# EAGLE schematic automatrix (EAGLE 9.3.2)
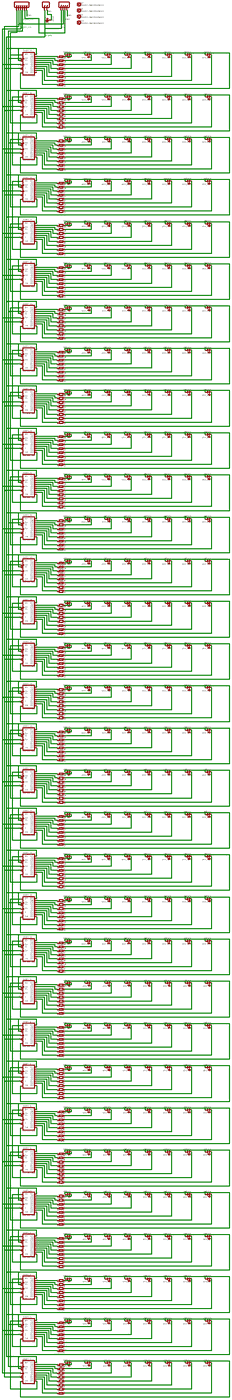
[diagram p0: schematic, sheet 1, overview]
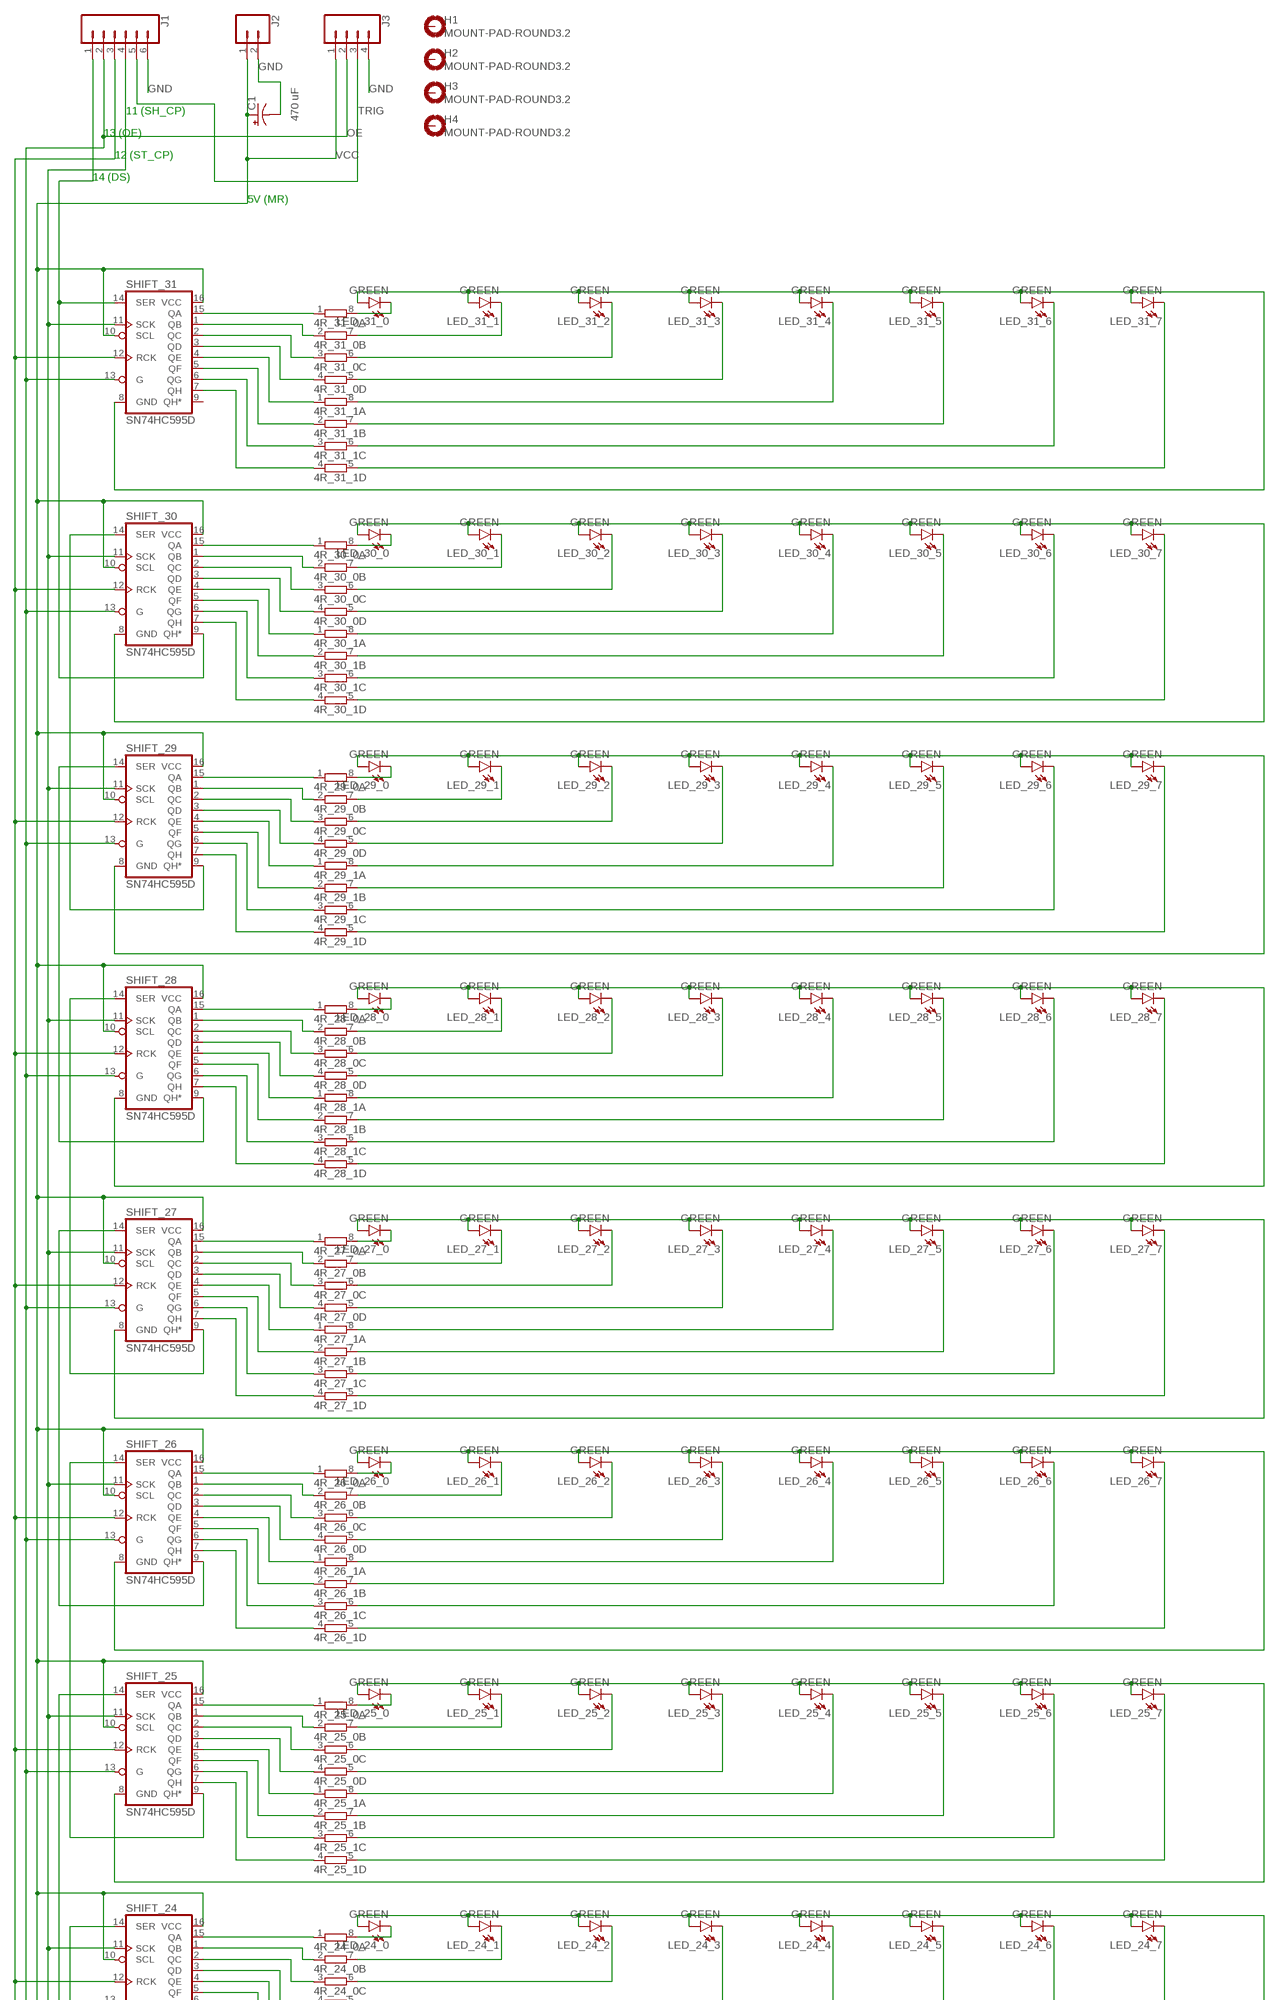
[diagram p1: schematic, sheet 1, part 1 of 4]
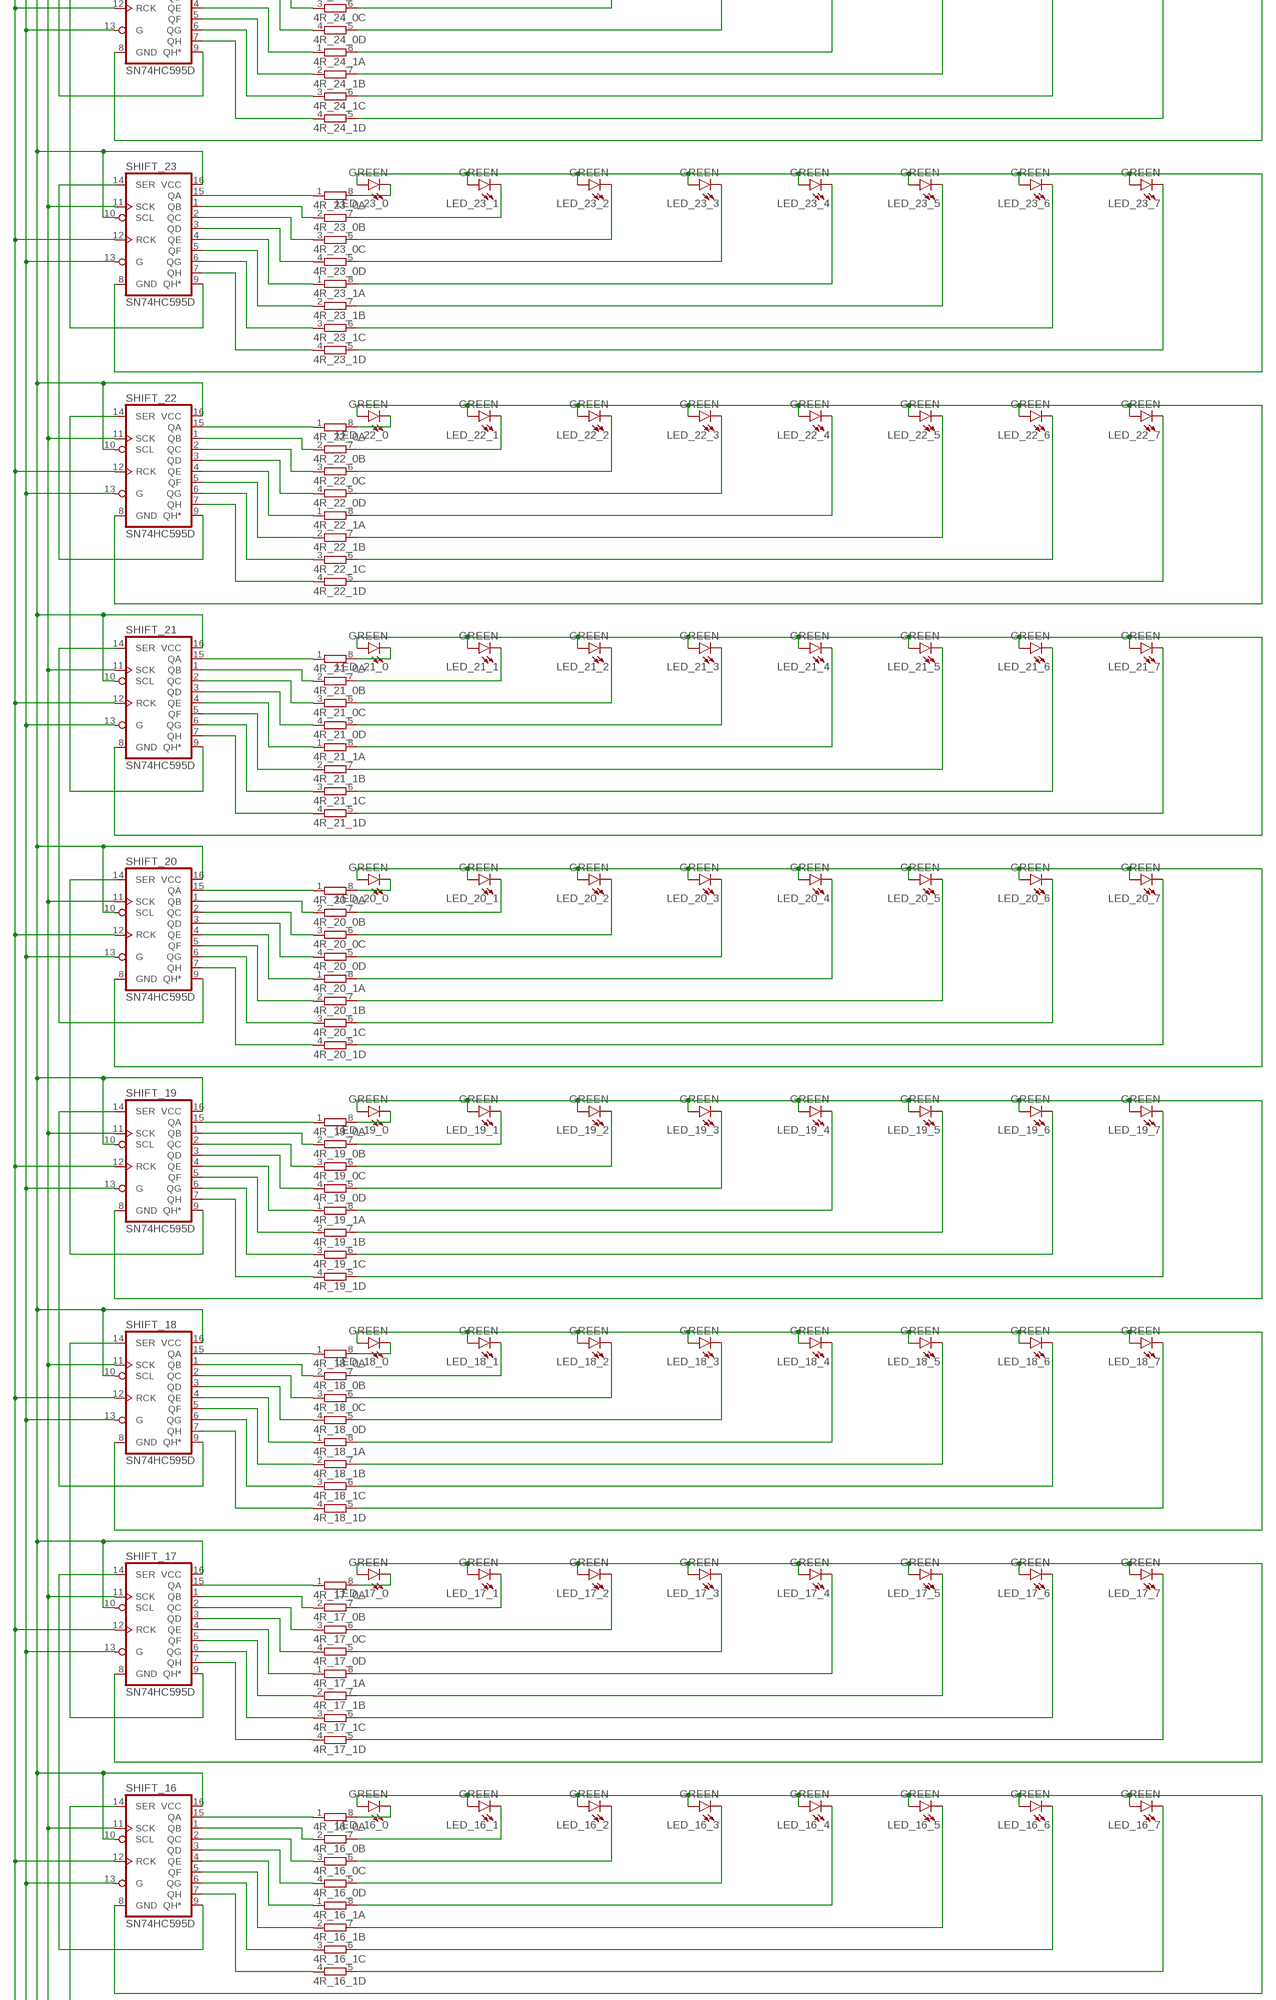
[diagram p2: schematic, sheet 1, part 2 of 4]
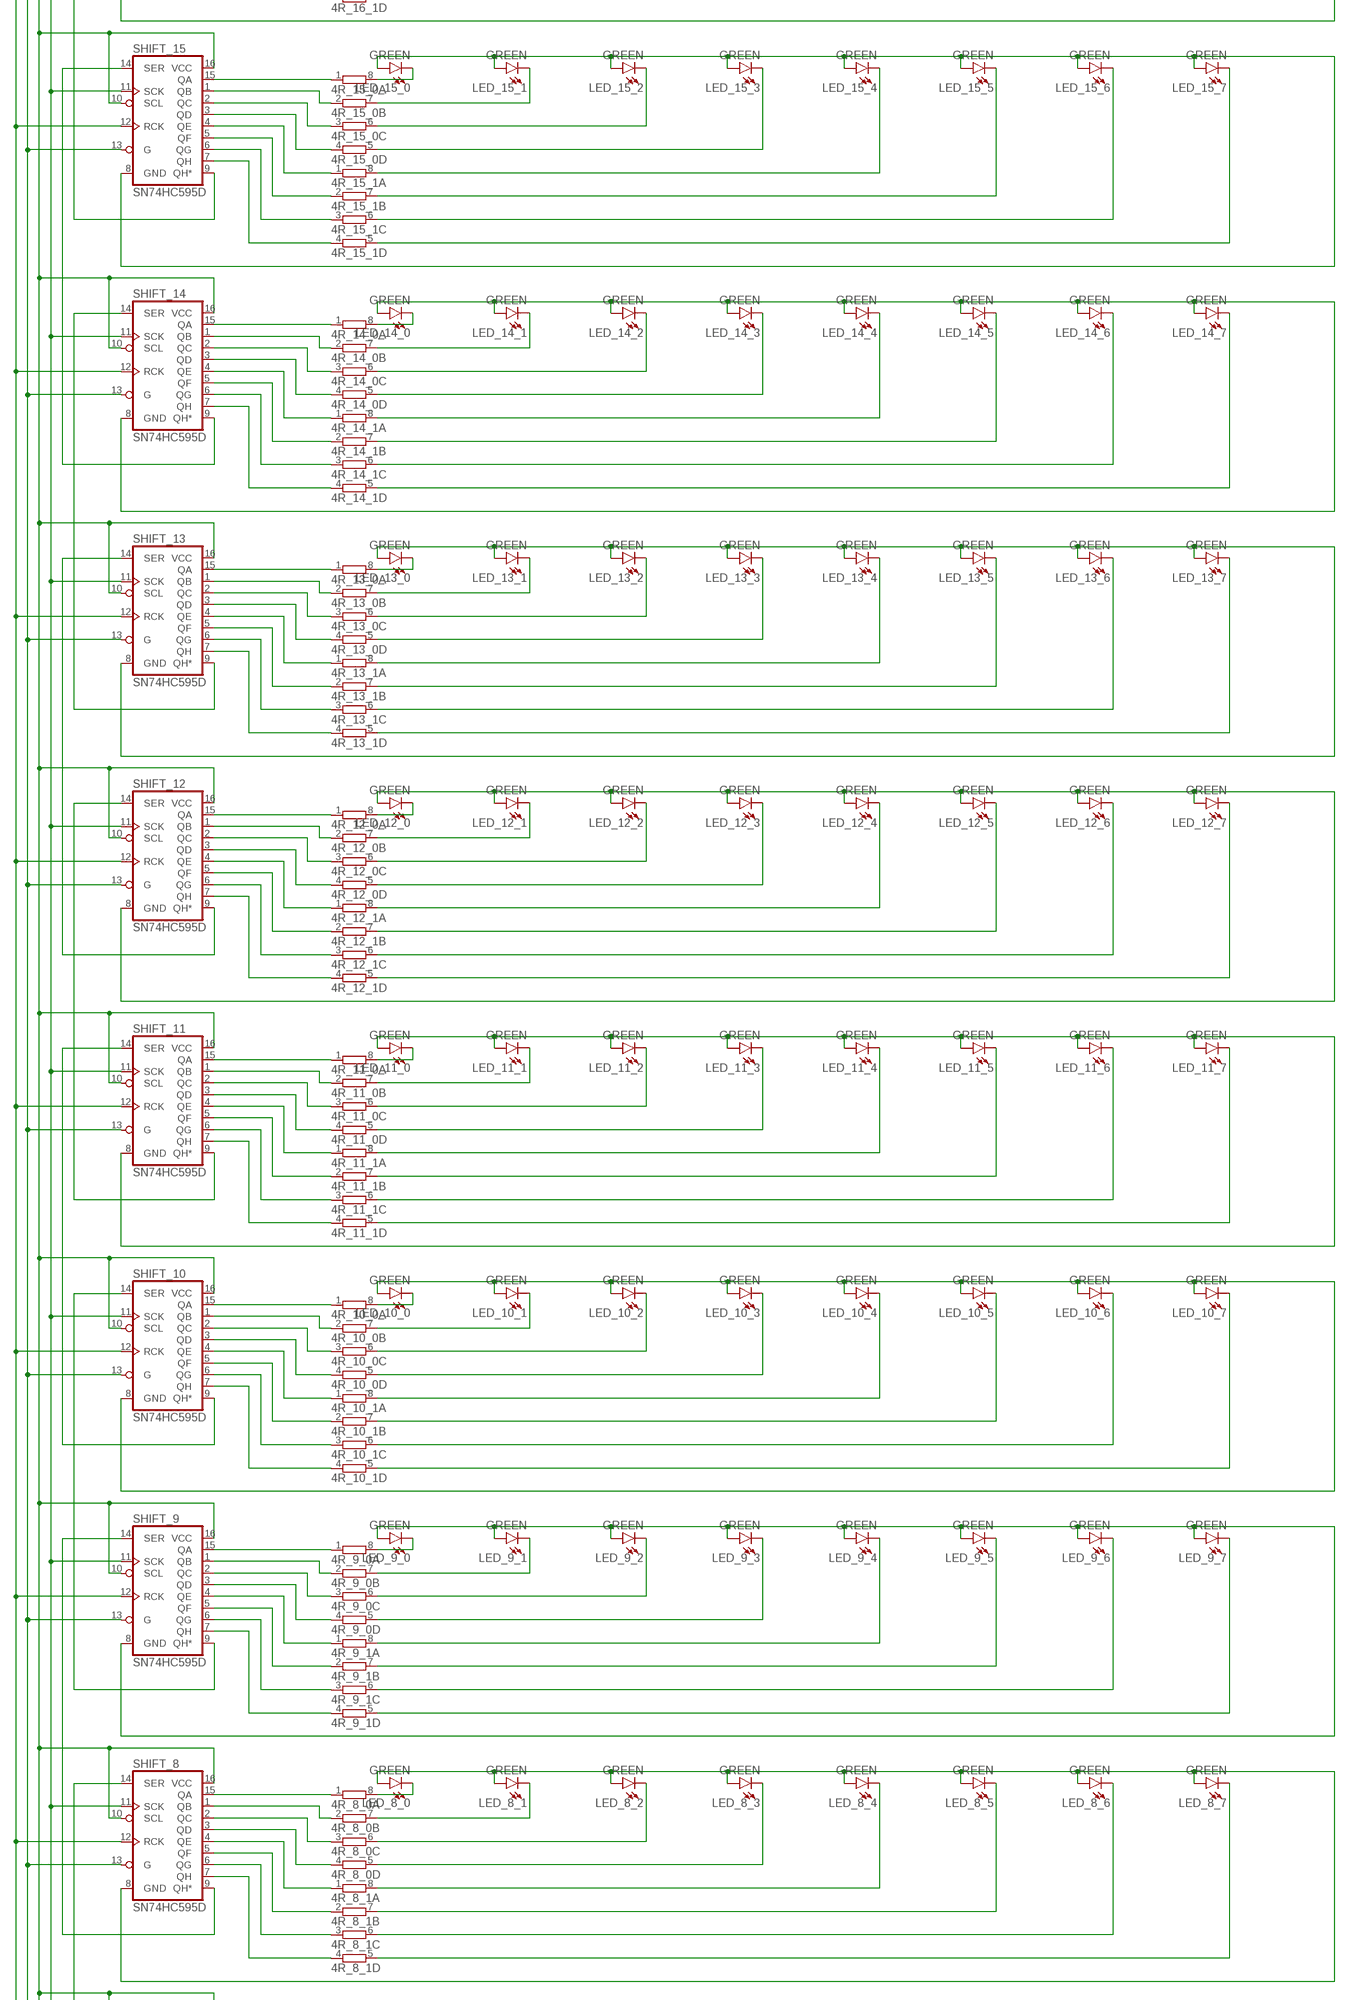
[diagram p3: schematic, sheet 1, part 3 of 4]
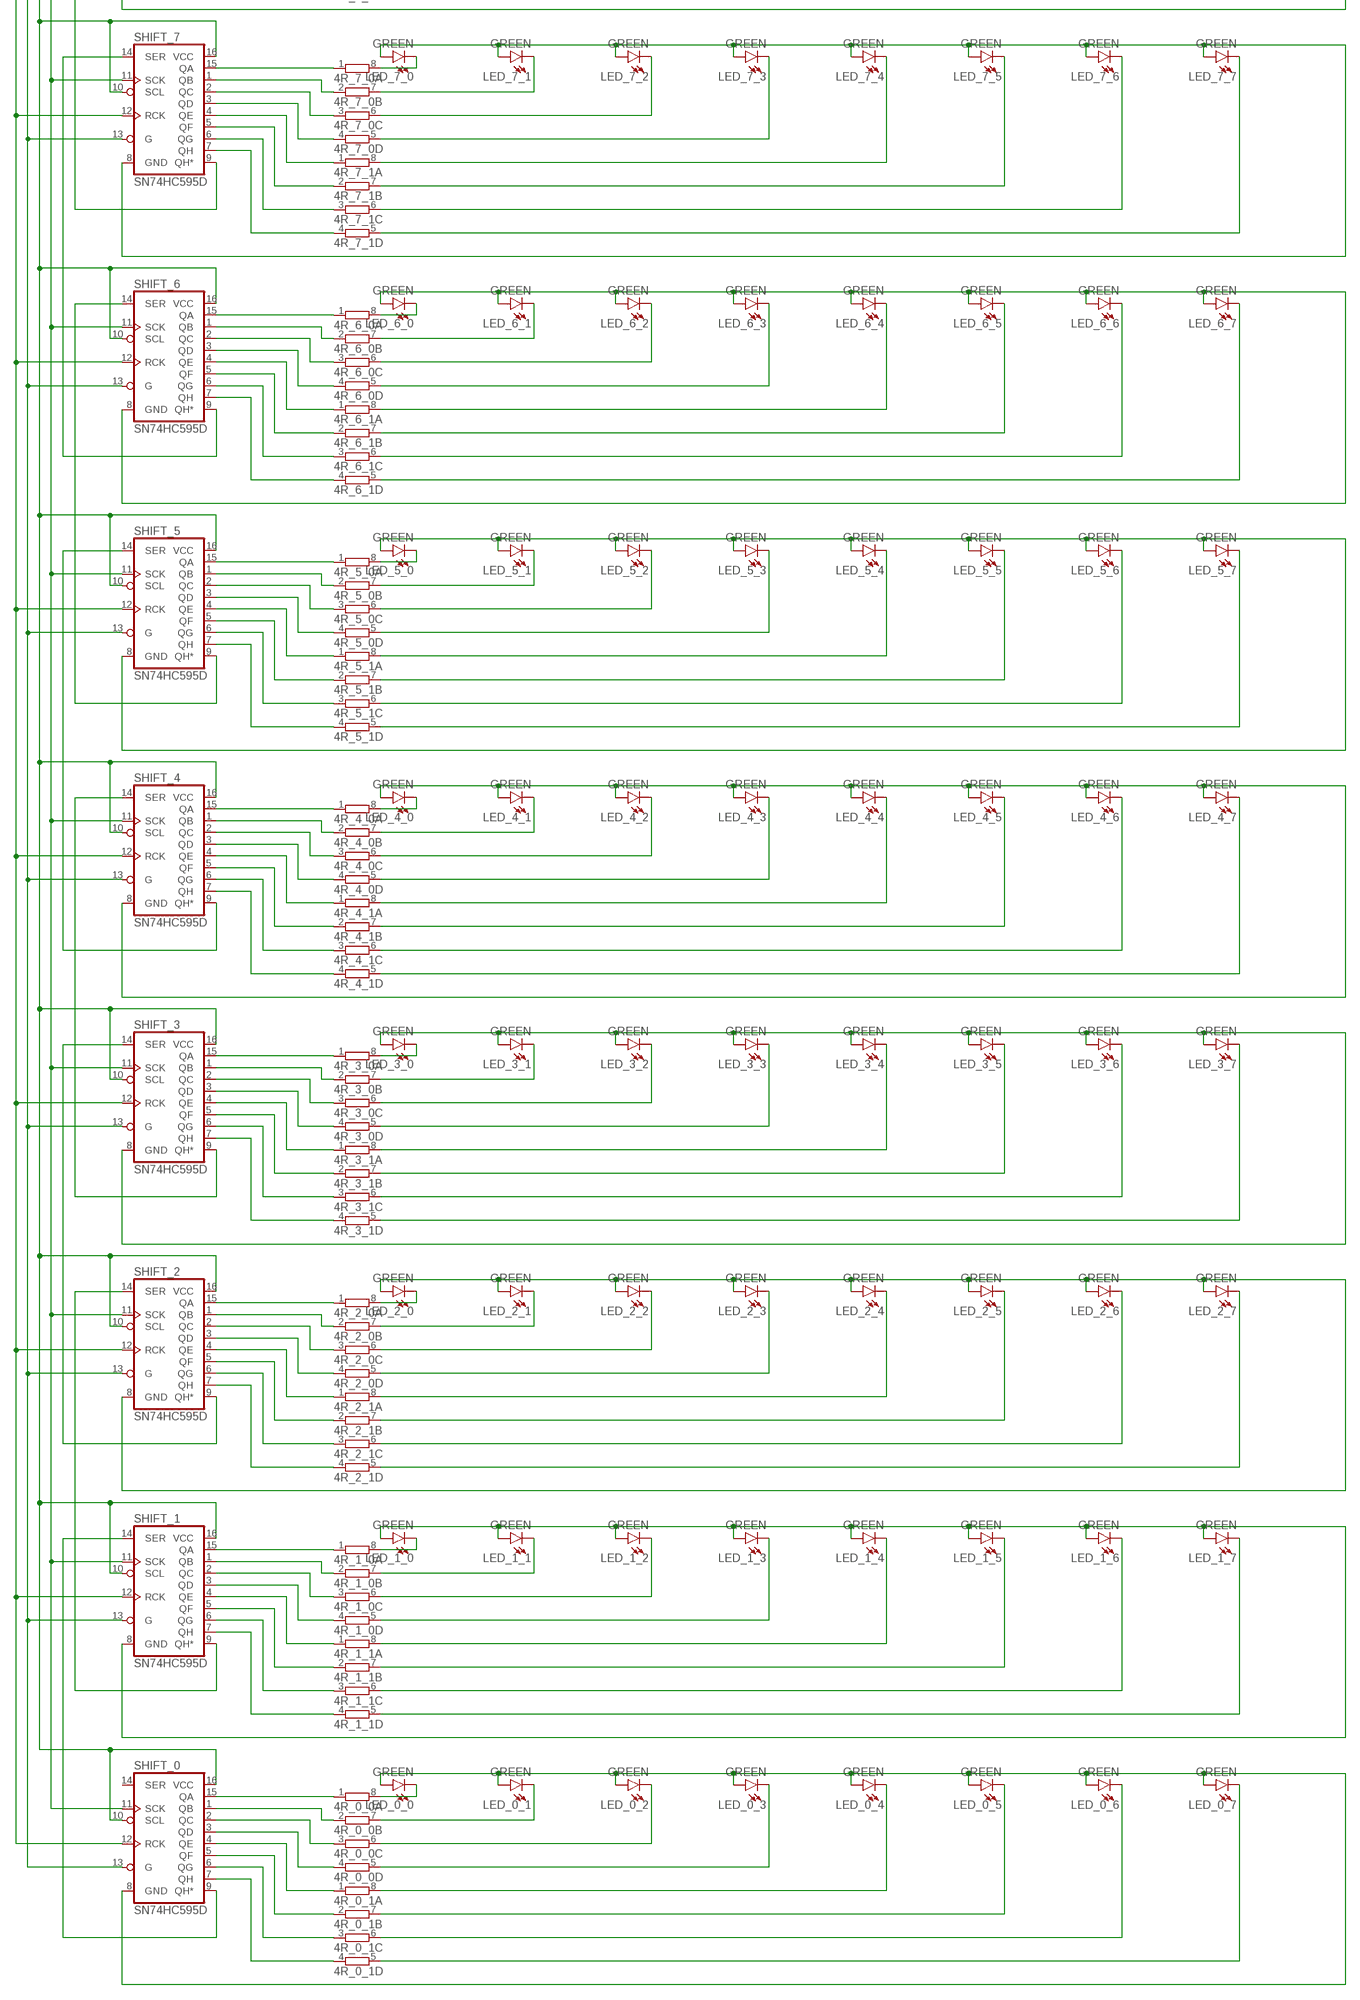
[diagram p4: schematic, sheet 1, part 4 of 4]

## Parts
4R_0_0  4R-N0603-ARC  [0603-ARC]
4R_0_1  4R-N0603-ARC  [0603-ARC]
4R_1_0  4R-N0603-ARC  [0603-ARC]
4R_1_1  4R-N0603-ARC  [0603-ARC]
4R_2_0  4R-N0603-ARC  [0603-ARC]
4R_2_1  4R-N0603-ARC  [0603-ARC]
4R_3_0  4R-N0603-ARC  [0603-ARC]
4R_3_1  4R-N0603-ARC  [0603-ARC]
4R_4_0  4R-N0603-ARC  [0603-ARC]
4R_4_1  4R-N0603-ARC  [0603-ARC]
4R_5_0  4R-N0603-ARC  [0603-ARC]
4R_5_1  4R-N0603-ARC  [0603-ARC]
4R_6_0  4R-N0603-ARC  [0603-ARC]
4R_6_1  4R-N0603-ARC  [0603-ARC]
4R_7_0  4R-N0603-ARC  [0603-ARC]
4R_7_1  4R-N0603-ARC  [0603-ARC]
4R_8_0  4R-N0603-ARC  [0603-ARC]
4R_8_1  4R-N0603-ARC  [0603-ARC]
4R_9_0  4R-N0603-ARC  [0603-ARC]
4R_9_1  4R-N0603-ARC  [0603-ARC]
4R_10_0  4R-N0603-ARC  [0603-ARC]
4R_10_1  4R-N0603-ARC  [0603-ARC]
4R_11_0  4R-N0603-ARC  [0603-ARC]
4R_11_1  4R-N0603-ARC  [0603-ARC]
4R_12_0  4R-N0603-ARC  [0603-ARC]
4R_12_1  4R-N0603-ARC  [0603-ARC]
4R_13_0  4R-N0603-ARC  [0603-ARC]
4R_13_1  4R-N0603-ARC  [0603-ARC]
4R_14_0  4R-N0603-ARC  [0603-ARC]
4R_14_1  4R-N0603-ARC  [0603-ARC]
4R_15_0  4R-N0603-ARC  [0603-ARC]
4R_15_1  4R-N0603-ARC  [0603-ARC]
4R_16_0  4R-N0603-ARC  [0603-ARC]
4R_16_1  4R-N0603-ARC  [0603-ARC]
4R_17_0  4R-N0603-ARC  [0603-ARC]
4R_17_1  4R-N0603-ARC  [0603-ARC]
4R_18_0  4R-N0603-ARC  [0603-ARC]
4R_18_1  4R-N0603-ARC  [0603-ARC]
4R_19_0  4R-N0603-ARC  [0603-ARC]
4R_19_1  4R-N0603-ARC  [0603-ARC]
4R_20_0  4R-N0603-ARC  [0603-ARC]
4R_20_1  4R-N0603-ARC  [0603-ARC]
4R_21_0  4R-N0603-ARC  [0603-ARC]
4R_21_1  4R-N0603-ARC  [0603-ARC]
4R_22_0  4R-N0603-ARC  [0603-ARC]
4R_22_1  4R-N0603-ARC  [0603-ARC]
4R_23_0  4R-N0603-ARC  [0603-ARC]
4R_23_1  4R-N0603-ARC  [0603-ARC]
4R_24_0  4R-N0603-ARC  [0603-ARC]
4R_24_1  4R-N0603-ARC  [0603-ARC]
4R_25_0  4R-N0603-ARC  [0603-ARC]
4R_25_1  4R-N0603-ARC  [0603-ARC]
4R_26_0  4R-N0603-ARC  [0603-ARC]
4R_26_1  4R-N0603-ARC  [0603-ARC]
4R_27_0  4R-N0603-ARC  [0603-ARC]
4R_27_1  4R-N0603-ARC  [0603-ARC]
4R_28_0  4R-N0603-ARC  [0603-ARC]
4R_28_1  4R-N0603-ARC  [0603-ARC]
4R_29_0  4R-N0603-ARC  [0603-ARC]
4R_29_1  4R-N0603-ARC  [0603-ARC]
4R_30_0  4R-N0603-ARC  [0603-ARC]
4R_30_1  4R-N0603-ARC  [0603-ARC]
4R_31_0  4R-N0603-ARC  [0603-ARC]
4R_31_1  4R-N0603-ARC  [0603-ARC]
C1  470 uF  1000UF-RADIAL-5MM-25V-20%  [CPOL-RADIAL-5MM-10MM]
H1  MOUNT-PAD-ROUND3.2  [3,2-PAD]
H2  MOUNT-PAD-ROUND3.2  [3,2-PAD]
H3  MOUNT-PAD-ROUND3.2  [3,2-PAD]
H4  MOUNT-PAD-ROUND3.2  [3,2-PAD]
J1  CONN_06NO_SILK_FEMALE_PTH  [1X06_NO_SILK]
J2  CONN_021X02_NO_SILK  [1X02_NO_SILK]
J3  CONN_041X04_NO_SILK  [1X04_NO_SILK]
LED_0_0  GREEN  LED-GREEN0603  [LED-0603]
LED_0_1  GREEN  LED-GREEN0603  [LED-0603]
LED_0_2  GREEN  LED-GREEN0603  [LED-0603]
LED_0_3  GREEN  LED-GREEN0603  [LED-0603]
LED_0_4  GREEN  LED-GREEN0603  [LED-0603]
LED_0_5  GREEN  LED-GREEN0603  [LED-0603]
LED_0_6  GREEN  LED-GREEN0603  [LED-0603]
LED_0_7  GREEN  LED-GREEN0603  [LED-0603]
LED_1_0  GREEN  LED-GREEN0603  [LED-0603]
LED_1_1  GREEN  LED-GREEN0603  [LED-0603]
LED_1_2  GREEN  LED-GREEN0603  [LED-0603]
LED_1_3  GREEN  LED-GREEN0603  [LED-0603]
LED_1_4  GREEN  LED-GREEN0603  [LED-0603]
LED_1_5  GREEN  LED-GREEN0603  [LED-0603]
LED_1_6  GREEN  LED-GREEN0603  [LED-0603]
LED_1_7  GREEN  LED-GREEN0603  [LED-0603]
LED_2_0  GREEN  LED-GREEN0603  [LED-0603]
LED_2_1  GREEN  LED-GREEN0603  [LED-0603]
LED_2_2  GREEN  LED-GREEN0603  [LED-0603]
LED_2_3  GREEN  LED-GREEN0603  [LED-0603]
LED_2_4  GREEN  LED-GREEN0603  [LED-0603]
LED_2_5  GREEN  LED-GREEN0603  [LED-0603]
LED_2_6  GREEN  LED-GREEN0603  [LED-0603]
LED_2_7  GREEN  LED-GREEN0603  [LED-0603]
LED_3_0  GREEN  LED-GREEN0603  [LED-0603]
LED_3_1  GREEN  LED-GREEN0603  [LED-0603]
LED_3_2  GREEN  LED-GREEN0603  [LED-0603]
LED_3_3  GREEN  LED-GREEN0603  [LED-0603]
LED_3_4  GREEN  LED-GREEN0603  [LED-0603]
LED_3_5  GREEN  LED-GREEN0603  [LED-0603]
LED_3_6  GREEN  LED-GREEN0603  [LED-0603]
LED_3_7  GREEN  LED-GREEN0603  [LED-0603]
LED_4_0  GREEN  LED-GREEN0603  [LED-0603]
LED_4_1  GREEN  LED-GREEN0603  [LED-0603]
LED_4_2  GREEN  LED-GREEN0603  [LED-0603]
LED_4_3  GREEN  LED-GREEN0603  [LED-0603]
LED_4_4  GREEN  LED-GREEN0603  [LED-0603]
LED_4_5  GREEN  LED-GREEN0603  [LED-0603]
LED_4_6  GREEN  LED-GREEN0603  [LED-0603]
LED_4_7  GREEN  LED-GREEN0603  [LED-0603]
LED_5_0  GREEN  LED-GREEN0603  [LED-0603]
LED_5_1  GREEN  LED-GREEN0603  [LED-0603]
LED_5_2  GREEN  LED-GREEN0603  [LED-0603]
LED_5_3  GREEN  LED-GREEN0603  [LED-0603]
LED_5_4  GREEN  LED-GREEN0603  [LED-0603]
LED_5_5  GREEN  LED-GREEN0603  [LED-0603]
LED_5_6  GREEN  LED-GREEN0603  [LED-0603]
LED_5_7  GREEN  LED-GREEN0603  [LED-0603]
LED_6_0  GREEN  LED-GREEN0603  [LED-0603]
LED_6_1  GREEN  LED-GREEN0603  [LED-0603]
LED_6_2  GREEN  LED-GREEN0603  [LED-0603]
LED_6_3  GREEN  LED-GREEN0603  [LED-0603]
LED_6_4  GREEN  LED-GREEN0603  [LED-0603]
LED_6_5  GREEN  LED-GREEN0603  [LED-0603]
LED_6_6  GREEN  LED-GREEN0603  [LED-0603]
LED_6_7  GREEN  LED-GREEN0603  [LED-0603]
LED_7_0  GREEN  LED-GREEN0603  [LED-0603]
LED_7_1  GREEN  LED-GREEN0603  [LED-0603]
LED_7_2  GREEN  LED-GREEN0603  [LED-0603]
LED_7_3  GREEN  LED-GREEN0603  [LED-0603]
LED_7_4  GREEN  LED-GREEN0603  [LED-0603]
LED_7_5  GREEN  LED-GREEN0603  [LED-0603]
LED_7_6  GREEN  LED-GREEN0603  [LED-0603]
LED_7_7  GREEN  LED-GREEN0603  [LED-0603]
LED_8_0  GREEN  LED-GREEN0603  [LED-0603]
LED_8_1  GREEN  LED-GREEN0603  [LED-0603]
LED_8_2  GREEN  LED-GREEN0603  [LED-0603]
LED_8_3  GREEN  LED-GREEN0603  [LED-0603]
LED_8_4  GREEN  LED-GREEN0603  [LED-0603]
LED_8_5  GREEN  LED-GREEN0603  [LED-0603]
LED_8_6  GREEN  LED-GREEN0603  [LED-0603]
LED_8_7  GREEN  LED-GREEN0603  [LED-0603]
LED_9_0  GREEN  LED-GREEN0603  [LED-0603]
LED_9_1  GREEN  LED-GREEN0603  [LED-0603]
LED_9_2  GREEN  LED-GREEN0603  [LED-0603]
LED_9_3  GREEN  LED-GREEN0603  [LED-0603]
LED_9_4  GREEN  LED-GREEN0603  [LED-0603]
LED_9_5  GREEN  LED-GREEN0603  [LED-0603]
LED_9_6  GREEN  LED-GREEN0603  [LED-0603]
LED_9_7  GREEN  LED-GREEN0603  [LED-0603]
LED_10_0  GREEN  LED-GREEN0603  [LED-0603]
LED_10_1  GREEN  LED-GREEN0603  [LED-0603]
LED_10_2  GREEN  LED-GREEN0603  [LED-0603]
LED_10_3  GREEN  LED-GREEN0603  [LED-0603]
LED_10_4  GREEN  LED-GREEN0603  [LED-0603]
LED_10_5  GREEN  LED-GREEN0603  [LED-0603]
LED_10_6  GREEN  LED-GREEN0603  [LED-0603]
LED_10_7  GREEN  LED-GREEN0603  [LED-0603]
LED_11_0  GREEN  LED-GREEN0603  [LED-0603]
LED_11_1  GREEN  LED-GREEN0603  [LED-0603]
LED_11_2  GREEN  LED-GREEN0603  [LED-0603]
LED_11_3  GREEN  LED-GREEN0603  [LED-0603]
LED_11_4  GREEN  LED-GREEN0603  [LED-0603]
LED_11_5  GREEN  LED-GREEN0603  [LED-0603]
LED_11_6  GREEN  LED-GREEN0603  [LED-0603]
LED_11_7  GREEN  LED-GREEN0603  [LED-0603]
LED_12_0  GREEN  LED-GREEN0603  [LED-0603]
LED_12_1  GREEN  LED-GREEN0603  [LED-0603]
LED_12_2  GREEN  LED-GREEN0603  [LED-0603]
LED_12_3  GREEN  LED-GREEN0603  [LED-0603]
LED_12_4  GREEN  LED-GREEN0603  [LED-0603]
LED_12_5  GREEN  LED-GREEN0603  [LED-0603]
LED_12_6  GREEN  LED-GREEN0603  [LED-0603]
LED_12_7  GREEN  LED-GREEN0603  [LED-0603]
LED_13_0  GREEN  LED-GREEN0603  [LED-0603]
LED_13_1  GREEN  LED-GREEN0603  [LED-0603]
LED_13_2  GREEN  LED-GREEN0603  [LED-0603]
LED_13_3  GREEN  LED-GREEN0603  [LED-0603]
LED_13_4  GREEN  LED-GREEN0603  [LED-0603]
LED_13_5  GREEN  LED-GREEN0603  [LED-0603]
LED_13_6  GREEN  LED-GREEN0603  [LED-0603]
LED_13_7  GREEN  LED-GREEN0603  [LED-0603]
LED_14_0  GREEN  LED-GREEN0603  [LED-0603]
LED_14_1  GREEN  LED-GREEN0603  [LED-0603]
LED_14_2  GREEN  LED-GREEN0603  [LED-0603]
LED_14_3  GREEN  LED-GREEN0603  [LED-0603]
LED_14_4  GREEN  LED-GREEN0603  [LED-0603]
LED_14_5  GREEN  LED-GREEN0603  [LED-0603]
LED_14_6  GREEN  LED-GREEN0603  [LED-0603]
LED_14_7  GREEN  LED-GREEN0603  [LED-0603]
LED_15_0  GREEN  LED-GREEN0603  [LED-0603]
LED_15_1  GREEN  LED-GREEN0603  [LED-0603]
LED_15_2  GREEN  LED-GREEN0603  [LED-0603]
LED_15_3  GREEN  LED-GREEN0603  [LED-0603]
LED_15_4  GREEN  LED-GREEN0603  [LED-0603]
LED_15_5  GREEN  LED-GREEN0603  [LED-0603]
LED_15_6  GREEN  LED-GREEN0603  [LED-0603]
LED_15_7  GREEN  LED-GREEN0603  [LED-0603]
LED_16_0  GREEN  LED-GREEN0603  [LED-0603]
LED_16_1  GREEN  LED-GREEN0603  [LED-0603]
LED_16_2  GREEN  LED-GREEN0603  [LED-0603]
LED_16_3  GREEN  LED-GREEN0603  [LED-0603]
LED_16_4  GREEN  LED-GREEN0603  [LED-0603]
LED_16_5  GREEN  LED-GREEN0603  [LED-0603]
LED_16_6  GREEN  LED-GREEN0603  [LED-0603]
LED_16_7  GREEN  LED-GREEN0603  [LED-0603]
LED_17_0  GREEN  LED-GREEN0603  [LED-0603]
LED_17_1  GREEN  LED-GREEN0603  [LED-0603]
LED_17_2  GREEN  LED-GREEN0603  [LED-0603]
LED_17_3  GREEN  LED-GREEN0603  [LED-0603]
LED_17_4  GREEN  LED-GREEN0603  [LED-0603]
LED_17_5  GREEN  LED-GREEN0603  [LED-0603]
LED_17_6  GREEN  LED-GREEN0603  [LED-0603]
LED_17_7  GREEN  LED-GREEN0603  [LED-0603]
LED_18_0  GREEN  LED-GREEN0603  [LED-0603]
LED_18_1  GREEN  LED-GREEN0603  [LED-0603]
LED_18_2  GREEN  LED-GREEN0603  [LED-0603]
LED_18_3  GREEN  LED-GREEN0603  [LED-0603]
LED_18_4  GREEN  LED-GREEN0603  [LED-0603]
LED_18_5  GREEN  LED-GREEN0603  [LED-0603]
LED_18_6  GREEN  LED-GREEN0603  [LED-0603]
LED_18_7  GREEN  LED-GREEN0603  [LED-0603]
LED_19_0  GREEN  LED-GREEN0603  [LED-0603]
LED_19_1  GREEN  LED-GREEN0603  [LED-0603]
LED_19_2  GREEN  LED-GREEN0603  [LED-0603]
LED_19_3  GREEN  LED-GREEN0603  [LED-0603]
LED_19_4  GREEN  LED-GREEN0603  [LED-0603]
LED_19_5  GREEN  LED-GREEN0603  [LED-0603]
LED_19_6  GREEN  LED-GREEN0603  [LED-0603]
LED_19_7  GREEN  LED-GREEN0603  [LED-0603]
LED_20_0  GREEN  LED-GREEN0603  [LED-0603]
LED_20_1  GREEN  LED-GREEN0603  [LED-0603]
LED_20_2  GREEN  LED-GREEN0603  [LED-0603]
LED_20_3  GREEN  LED-GREEN0603  [LED-0603]
LED_20_4  GREEN  LED-GREEN0603  [LED-0603]
LED_20_5  GREEN  LED-GREEN0603  [LED-0603]
LED_20_6  GREEN  LED-GREEN0603  [LED-0603]
LED_20_7  GREEN  LED-GREEN0603  [LED-0603]
LED_21_0  GREEN  LED-GREEN0603  [LED-0603]
LED_21_1  GREEN  LED-GREEN0603  [LED-0603]
LED_21_2  GREEN  LED-GREEN0603  [LED-0603]
LED_21_3  GREEN  LED-GREEN0603  [LED-0603]
LED_21_4  GREEN  LED-GREEN0603  [LED-0603]
LED_21_5  GREEN  LED-GREEN0603  [LED-0603]
LED_21_6  GREEN  LED-GREEN0603  [LED-0603]
LED_21_7  GREEN  LED-GREEN0603  [LED-0603]
LED_22_0  GREEN  LED-GREEN0603  [LED-0603]
LED_22_1  GREEN  LED-GREEN0603  [LED-0603]
LED_22_2  GREEN  LED-GREEN0603  [LED-0603]
LED_22_3  GREEN  LED-GREEN0603  [LED-0603]
LED_22_4  GREEN  LED-GREEN0603  [LED-0603]
LED_22_5  GREEN  LED-GREEN0603  [LED-0603]
LED_22_6  GREEN  LED-GREEN0603  [LED-0603]
LED_22_7  GREEN  LED-GREEN0603  [LED-0603]
LED_23_0  GREEN  LED-GREEN0603  [LED-0603]
LED_23_1  GREEN  LED-GREEN0603  [LED-0603]
LED_23_2  GREEN  LED-GREEN0603  [LED-0603]
LED_23_3  GREEN  LED-GREEN0603  [LED-0603]
LED_23_4  GREEN  LED-GREEN0603  [LED-0603]
LED_23_5  GREEN  LED-GREEN0603  [LED-0603]
LED_23_6  GREEN  LED-GREEN0603  [LED-0603]
LED_23_7  GREEN  LED-GREEN0603  [LED-0603]
LED_24_0  GREEN  LED-GREEN0603  [LED-0603]
LED_24_1  GREEN  LED-GREEN0603  [LED-0603]
LED_24_2  GREEN  LED-GREEN0603  [LED-0603]
LED_24_3  GREEN  LED-GREEN0603  [LED-0603]
LED_24_4  GREEN  LED-GREEN0603  [LED-0603]
LED_24_5  GREEN  LED-GREEN0603  [LED-0603]
LED_24_6  GREEN  LED-GREEN0603  [LED-0603]
LED_24_7  GREEN  LED-GREEN0603  [LED-0603]
LED_25_0  GREEN  LED-GREEN0603  [LED-0603]
LED_25_1  GREEN  LED-GREEN0603  [LED-0603]
LED_25_2  GREEN  LED-GREEN0603  [LED-0603]
LED_25_3  GREEN  LED-GREEN0603  [LED-0603]
LED_25_4  GREEN  LED-GREEN0603  [LED-0603]
LED_25_5  GREEN  LED-GREEN0603  [LED-0603]
LED_25_6  GREEN  LED-GREEN0603  [LED-0603]
LED_25_7  GREEN  LED-GREEN0603  [LED-0603]
LED_26_0  GREEN  LED-GREEN0603  [LED-0603]
LED_26_1  GREEN  LED-GREEN0603  [LED-0603]
LED_26_2  GREEN  LED-GREEN0603  [LED-0603]
LED_26_3  GREEN  LED-GREEN0603  [LED-0603]
LED_26_4  GREEN  LED-GREEN0603  [LED-0603]
LED_26_5  GREEN  LED-GREEN0603  [LED-0603]
LED_26_6  GREEN  LED-GREEN0603  [LED-0603]
LED_26_7  GREEN  LED-GREEN0603  [LED-0603]
LED_27_0  GREEN  LED-GREEN0603  [LED-0603]
LED_27_1  GREEN  LED-GREEN0603  [LED-0603]
LED_27_2  GREEN  LED-GREEN0603  [LED-0603]
LED_27_3  GREEN  LED-GREEN0603  [LED-0603]
LED_27_4  GREEN  LED-GREEN0603  [LED-0603]
LED_27_5  GREEN  LED-GREEN0603  [LED-0603]
LED_27_6  GREEN  LED-GREEN0603  [LED-0603]
LED_27_7  GREEN  LED-GREEN0603  [LED-0603]
LED_28_0  GREEN  LED-GREEN0603  [LED-0603]
LED_28_1  GREEN  LED-GREEN0603  [LED-0603]
LED_28_2  GREEN  LED-GREEN0603  [LED-0603]
LED_28_3  GREEN  LED-GREEN0603  [LED-0603]
LED_28_4  GREEN  LED-GREEN0603  [LED-0603]
LED_28_5  GREEN  LED-GREEN0603  [LED-0603]
LED_28_6  GREEN  LED-GREEN0603  [LED-0603]
LED_28_7  GREEN  LED-GREEN0603  [LED-0603]
LED_29_0  GREEN  LED-GREEN0603  [LED-0603]
LED_29_1  GREEN  LED-GREEN0603  [LED-0603]
LED_29_2  GREEN  LED-GREEN0603  [LED-0603]
LED_29_3  GREEN  LED-GREEN0603  [LED-0603]
LED_29_4  GREEN  LED-GREEN0603  [LED-0603]
LED_29_5  GREEN  LED-GREEN0603  [LED-0603]
LED_29_6  GREEN  LED-GREEN0603  [LED-0603]
LED_29_7  GREEN  LED-GREEN0603  [LED-0603]
LED_30_0  GREEN  LED-GREEN0603  [LED-0603]
LED_30_1  GREEN  LED-GREEN0603  [LED-0603]
LED_30_2  GREEN  LED-GREEN0603  [LED-0603]
LED_30_3  GREEN  LED-GREEN0603  [LED-0603]
LED_30_4  GREEN  LED-GREEN0603  [LED-0603]
LED_30_5  GREEN  LED-GREEN0603  [LED-0603]
LED_30_6  GREEN  LED-GREEN0603  [LED-0603]
LED_30_7  GREEN  LED-GREEN0603  [LED-0603]
LED_31_0  GREEN  LED-GREEN0603  [LED-0603]
LED_31_1  GREEN  LED-GREEN0603  [LED-0603]
LED_31_2  GREEN  LED-GREEN0603  [LED-0603]
LED_31_3  GREEN  LED-GREEN0603  [LED-0603]
LED_31_4  GREEN  LED-GREEN0603  [LED-0603]
LED_31_5  GREEN  LED-GREEN0603  [LED-0603]
LED_31_6  GREEN  LED-GREEN0603  [LED-0603]
LED_31_7  GREEN  LED-GREEN0603  [LED-0603]
SHIFT_0  SN74HC595D  74HC595D  [SO16]
SHIFT_1  SN74HC595D  74HC595D  [SO16]
SHIFT_2  SN74HC595D  74HC595D  [SO16]
SHIFT_3  SN74HC595D  74HC595D  [SO16]
SHIFT_4  SN74HC595D  74HC595D  [SO16]
SHIFT_5  SN74HC595D  74HC595D  [SO16]
SHIFT_6  SN74HC595D  74HC595D  [SO16]
SHIFT_7  SN74HC595D  74HC595D  [SO16]
SHIFT_8  SN74HC595D  74HC595D  [SO16]
SHIFT_9  SN74HC595D  74HC595D  [SO16]
SHIFT_10  SN74HC595D  74HC595D  [SO16]
SHIFT_11  SN74HC595D  74HC595D  [SO16]
SHIFT_12  SN74HC595D  74HC595D  [SO16]
SHIFT_13  SN74HC595D  74HC595D  [SO16]
SHIFT_14  SN74HC595D  74HC595D  [SO16]
SHIFT_15  SN74HC595D  74HC595D  [SO16]
SHIFT_16  SN74HC595D  74HC595D  [SO16]
SHIFT_17  SN74HC595D  74HC595D  [SO16]
SHIFT_18  SN74HC595D  74HC595D  [SO16]
SHIFT_19  SN74HC595D  74HC595D  [SO16]
SHIFT_20  SN74HC595D  74HC595D  [SO16]
SHIFT_21  SN74HC595D  74HC595D  [SO16]
SHIFT_22  SN74HC595D  74HC595D  [SO16]
SHIFT_23  SN74HC595D  74HC595D  [SO16]
SHIFT_24  SN74HC595D  74HC595D  [SO16]
SHIFT_25  SN74HC595D  74HC595D  [SO16]
SHIFT_26  SN74HC595D  74HC595D  [SO16]
SHIFT_27  SN74HC595D  74HC595D  [SO16]
SHIFT_28  SN74HC595D  74HC595D  [SO16]
SHIFT_29  SN74HC595D  74HC595D  [SO16]
SHIFT_30  SN74HC595D  74HC595D  [SO16]
SHIFT_31  SN74HC595D  74HC595D  [SO16]

## Nets
CLK: J1.4 SHIFT_0.11(SCK) SHIFT_1.11(SCK) SHIFT_2.11(SCK) SHIFT_3.11(SCK) SHIFT_4.11(SCK) SHIFT_5.11(SCK) SHIFT_6.11(SCK) SHIFT_7.11(SCK) SHIFT_8.11(SCK) SHIFT_9.11(SCK) SHIFT_10.11(SCK) SHIFT_11.11(SCK) SHIFT_12.11(SCK) SHIFT_13.11(SCK) SHIFT_14.11(SCK) SHIFT_15.11(SCK) SHIFT_16.11(SCK) SHIFT_17.11(SCK) SHIFT_18.11(SCK) SHIFT_19.11(SCK) SHIFT_20.11(SCK) SHIFT_21.11(SCK) SHIFT_22.11(SCK) SHIFT_23.11(SCK) SHIFT_24.11(SCK) SHIFT_25.11(SCK) SHIFT_26.11(SCK) SHIFT_27.11(SCK) SHIFT_28.11(SCK) SHIFT_29.11(SCK) SHIFT_30.11(SCK) SHIFT_31.11(SCK)
GND: C1.- J1.6 J2.2 J3.4 LED_0_0.A LED_0_1.A LED_0_2.A LED_0_3.A LED_0_4.A LED_0_5.A LED_0_6.A LED_0_7.A LED_1_0.A LED_1_1.A LED_1_2.A LED_1_3.A LED_1_4.A LED_1_5.A LED_1_6.A LED_1_7.A LED_2_0.A LED_2_1.A LED_2_2.A LED_2_3.A LED_2_4.A LED_2_5.A LED_2_6.A LED_2_7.A LED_3_0.A LED_3_1.A LED_3_2.A LED_3_3.A LED_3_4.A LED_3_5.A LED_3_6.A LED_3_7.A LED_4_0.A LED_4_1.A LED_4_2.A LED_4_3.A LED_4_4.A LED_4_5.A LED_4_6.A LED_4_7.A LED_5_0.A LED_5_1.A LED_5_2.A LED_5_3.A LED_5_4.A LED_5_5.A LED_5_6.A LED_5_7.A LED_6_0.A LED_6_1.A LED_6_2.A LED_6_3.A LED_6_4.A LED_6_5.A LED_6_6.A LED_6_7.A LED_7_0.A LED_7_1.A LED_7_2.A LED_7_3.A LED_7_4.A LED_7_5.A LED_7_6.A LED_7_7.A LED_8_0.A LED_8_1.A LED_8_2.A LED_8_3.A LED_8_4.A LED_8_5.A LED_8_6.A LED_8_7.A LED_9_0.A LED_9_1.A LED_9_2.A LED_9_3.A LED_9_4.A LED_9_5.A LED_9_6.A LED_9_7.A LED_10_0.A LED_10_1.A LED_10_2.A LED_10_3.A LED_10_4.A LED_10_5.A LED_10_6.A LED_10_7.A LED_11_0.A LED_11_1.A LED_11_2.A LED_11_3.A LED_11_4.A LED_11_5.A LED_11_6.A LED_11_7.A LED_12_0.A LED_12_1.A LED_12_2.A LED_12_3.A LED_12_4.A LED_12_5.A LED_12_6.A LED_12_7.A LED_13_0.A LED_13_1.A LED_13_2.A LED_13_3.A LED_13_4.A LED_13_5.A LED_13_6.A LED_13_7.A LED_14_0.A LED_14_1.A LED_14_2.A LED_14_3.A LED_14_4.A LED_14_5.A LED_14_6.A LED_14_7.A LED_15_0.A LED_15_1.A LED_15_2.A LED_15_3.A LED_15_4.A LED_15_5.A LED_15_6.A LED_15_7.A LED_16_0.A LED_16_1.A LED_16_2.A LED_16_3.A LED_16_4.A LED_16_5.A LED_16_6.A LED_16_7.A LED_17_0.A LED_17_1.A LED_17_2.A LED_17_3.A LED_17_4.A LED_17_5.A LED_17_6.A LED_17_7.A LED_18_0.A LED_18_1.A LED_18_2.A LED_18_3.A LED_18_4.A LED_18_5.A LED_18_6.A LED_18_7.A LED_19_0.A LED_19_1.A LED_19_2.A LED_19_3.A LED_19_4.A LED_19_5.A LED_19_6.A LED_19_7.A LED_20_0.A LED_20_1.A LED_20_2.A LED_20_3.A LED_20_4.A LED_20_5.A LED_20_6.A LED_20_7.A LED_21_0.A LED_21_1.A LED_21_2.A LED_21_3.A LED_21_4.A LED_21_5.A LED_21_6.A LED_21_7.A LED_22_0.A LED_22_1.A LED_22_2.A LED_22_3.A LED_22_4.A LED_22_5.A LED_22_6.A LED_22_7.A LED_23_0.A LED_23_1.A LED_23_2.A LED_23_3.A LED_23_4.A LED_23_5.A LED_23_6.A LED_23_7.A LED_24_0.A LED_24_1.A LED_24_2.A LED_24_3.A LED_24_4.A LED_24_5.A LED_24_6.A LED_24_7.A LED_25_0.A LED_25_1.A LED_25_2.A LED_25_3.A LED_25_4.A LED_25_5.A LED_25_6.A LED_25_7.A LED_26_0.A LED_26_1.A LED_26_2.A LED_26_3.A LED_26_4.A LED_26_5.A LED_26_6.A LED_26_7.A LED_27_0.A LED_27_1.A LED_27_2.A LED_27_3.A LED_27_4.A LED_27_5.A LED_27_6.A LED_27_7.A LED_28_0.A LED_28_1.A LED_28_2.A LED_28_3.A LED_28_4.A LED_28_5.A LED_28_6.A LED_28_7.A LED_29_0.A LED_29_1.A LED_29_2.A LED_29_3.A LED_29_4.A LED_29_5.A LED_29_6.A LED_29_7.A LED_30_0.A LED_30_1.A LED_30_2.A LED_30_3.A LED_30_4.A LED_30_5.A LED_30_6.A LED_30_7.A LED_31_0.A LED_31_1.A LED_31_2.A LED_31_3.A LED_31_4.A LED_31_5.A LED_31_6.A LED_31_7.A SHIFT_0.8(GND) SHIFT_1.8(GND) SHIFT_2.8(GND) SHIFT_3.8(GND) SHIFT_4.8(GND) SHIFT_5.8(GND) SHIFT_6.8(GND) SHIFT_7.8(GND) SHIFT_8.8(GND) SHIFT_9.8(GND) SHIFT_10.8(GND) SHIFT_11.8(GND) SHIFT_12.8(GND) SHIFT_13.8(GND) SHIFT_14.8(GND) SHIFT_15.8(GND) SHIFT_16.8(GND) SHIFT_17.8(GND) SHIFT_18.8(GND) SHIFT_19.8(GND) SHIFT_20.8(GND) SHIFT_21.8(GND) SHIFT_22.8(GND) SHIFT_23.8(GND) SHIFT_24.8(GND) SHIFT_25.8(GND) SHIFT_26.8(GND) SHIFT_27.8(GND) SHIFT_28.8(GND) SHIFT_29.8(GND) SHIFT_30.8(GND) SHIFT_31.8(GND)
OE: J1.2 J3.2 SHIFT_0.13(G) SHIFT_1.13(G) SHIFT_2.13(G) SHIFT_3.13(G) SHIFT_4.13(G) SHIFT_5.13(G) SHIFT_6.13(G) SHIFT_7.13(G) SHIFT_8.13(G) SHIFT_9.13(G) SHIFT_10.13(G) SHIFT_11.13(G) SHIFT_12.13(G) SHIFT_13.13(G) SHIFT_14.13(G) SHIFT_15.13(G) SHIFT_16.13(G) SHIFT_17.13(G) SHIFT_18.13(G) SHIFT_19.13(G) SHIFT_20.13(G) SHIFT_21.13(G) SHIFT_22.13(G) SHIFT_23.13(G) SHIFT_24.13(G) SHIFT_25.13(G) SHIFT_26.13(G) SHIFT_27.13(G) SHIFT_28.13(G) SHIFT_29.13(G) SHIFT_30.13(G) SHIFT_31.13(G)
Q0_0: 4R_0_0.1 4R_0_0.8 LED_0_0.C SHIFT_0.15(QA)
Q0_1: 4R_0_0.2 4R_0_0.7 LED_0_1.C SHIFT_0.1(QB)
Q0_2: 4R_0_0.3 4R_0_0.6 LED_0_2.C SHIFT_0.2(QC)
Q0_3: 4R_0_0.4 4R_0_0.5 LED_0_3.C SHIFT_0.3(QD)
Q0_4: 4R_0_1.1 4R_0_1.8 LED_0_4.C SHIFT_0.4(QE)
Q0_5: 4R_0_1.2 4R_0_1.7 LED_0_5.C SHIFT_0.5(QF)
Q0_6: 4R_0_1.3 4R_0_1.6 LED_0_6.C SHIFT_0.6(QG)
Q0_7: 4R_0_1.4 4R_0_1.5 LED_0_7.C SHIFT_0.7(QH)
Q1_0: 4R_1_0.1 4R_1_0.8 LED_1_0.C SHIFT_1.15(QA)
Q1_1: 4R_1_0.2 4R_1_0.7 LED_1_1.C SHIFT_1.1(QB)
Q1_2: 4R_1_0.3 4R_1_0.6 LED_1_2.C SHIFT_1.2(QC)
Q1_3: 4R_1_0.4 4R_1_0.5 LED_1_3.C SHIFT_1.3(QD)
Q1_4: 4R_1_1.1 4R_1_1.8 LED_1_4.C SHIFT_1.4(QE)
Q1_5: 4R_1_1.2 4R_1_1.7 LED_1_5.C SHIFT_1.5(QF)
Q1_6: 4R_1_1.3 4R_1_1.6 LED_1_6.C SHIFT_1.6(QG)
Q1_7: 4R_1_1.4 4R_1_1.5 LED_1_7.C SHIFT_1.7(QH)
Q2_0: 4R_2_0.1 4R_2_0.8 LED_2_0.C SHIFT_2.15(QA)
Q2_1: 4R_2_0.2 4R_2_0.7 LED_2_1.C SHIFT_2.1(QB)
Q2_2: 4R_2_0.3 4R_2_0.6 LED_2_2.C SHIFT_2.2(QC)
Q2_3: 4R_2_0.4 4R_2_0.5 LED_2_3.C SHIFT_2.3(QD)
Q2_4: 4R_2_1.1 4R_2_1.8 LED_2_4.C SHIFT_2.4(QE)
Q2_5: 4R_2_1.2 4R_2_1.7 LED_2_5.C SHIFT_2.5(QF)
Q2_6: 4R_2_1.3 4R_2_1.6 LED_2_6.C SHIFT_2.6(QG)
Q2_7: 4R_2_1.4 4R_2_1.5 LED_2_7.C SHIFT_2.7(QH)
Q3_0: 4R_3_0.1 4R_3_0.8 LED_3_0.C SHIFT_3.15(QA)
Q3_1: 4R_3_0.2 4R_3_0.7 LED_3_1.C SHIFT_3.1(QB)
Q3_2: 4R_3_0.3 4R_3_0.6 LED_3_2.C SHIFT_3.2(QC)
Q3_3: 4R_3_0.4 4R_3_0.5 LED_3_3.C SHIFT_3.3(QD)
Q3_4: 4R_3_1.1 4R_3_1.8 LED_3_4.C SHIFT_3.4(QE)
Q3_5: 4R_3_1.2 4R_3_1.7 LED_3_5.C SHIFT_3.5(QF)
Q3_6: 4R_3_1.3 4R_3_1.6 LED_3_6.C SHIFT_3.6(QG)
Q3_7: 4R_3_1.4 4R_3_1.5 LED_3_7.C SHIFT_3.7(QH)
Q4_0: 4R_4_0.1 4R_4_0.8 LED_4_0.C SHIFT_4.15(QA)
Q4_1: 4R_4_0.2 4R_4_0.7 LED_4_1.C SHIFT_4.1(QB)
Q4_2: 4R_4_0.3 4R_4_0.6 LED_4_2.C SHIFT_4.2(QC)
Q4_3: 4R_4_0.4 4R_4_0.5 LED_4_3.C SHIFT_4.3(QD)
Q4_4: 4R_4_1.1 4R_4_1.8 LED_4_4.C SHIFT_4.4(QE)
Q4_5: 4R_4_1.2 4R_4_1.7 LED_4_5.C SHIFT_4.5(QF)
Q4_6: 4R_4_1.3 4R_4_1.6 LED_4_6.C SHIFT_4.6(QG)
Q4_7: 4R_4_1.4 4R_4_1.5 LED_4_7.C SHIFT_4.7(QH)
Q5_0: 4R_5_0.1 4R_5_0.8 LED_5_0.C SHIFT_5.15(QA)
Q5_1: 4R_5_0.2 4R_5_0.7 LED_5_1.C SHIFT_5.1(QB)
Q5_2: 4R_5_0.3 4R_5_0.6 LED_5_2.C SHIFT_5.2(QC)
Q5_3: 4R_5_0.4 4R_5_0.5 LED_5_3.C SHIFT_5.3(QD)
Q5_4: 4R_5_1.1 4R_5_1.8 LED_5_4.C SHIFT_5.4(QE)
Q5_5: 4R_5_1.2 4R_5_1.7 LED_5_5.C SHIFT_5.5(QF)
Q5_6: 4R_5_1.3 4R_5_1.6 LED_5_6.C SHIFT_5.6(QG)
Q5_7: 4R_5_1.4 4R_5_1.5 LED_5_7.C SHIFT_5.7(QH)
Q6_0: 4R_6_0.1 4R_6_0.8 LED_6_0.C SHIFT_6.15(QA)
Q6_1: 4R_6_0.2 4R_6_0.7 LED_6_1.C SHIFT_6.1(QB)
Q6_2: 4R_6_0.3 4R_6_0.6 LED_6_2.C SHIFT_6.2(QC)
Q6_3: 4R_6_0.4 4R_6_0.5 LED_6_3.C SHIFT_6.3(QD)
Q6_4: 4R_6_1.1 4R_6_1.8 LED_6_4.C SHIFT_6.4(QE)
Q6_5: 4R_6_1.2 4R_6_1.7 LED_6_5.C SHIFT_6.5(QF)
Q6_6: 4R_6_1.3 4R_6_1.6 LED_6_6.C SHIFT_6.6(QG)
Q6_7: 4R_6_1.4 4R_6_1.5 LED_6_7.C SHIFT_6.7(QH)
Q7_0: 4R_7_0.1 4R_7_0.8 LED_7_0.C SHIFT_7.15(QA)
Q7_1: 4R_7_0.2 4R_7_0.7 LED_7_1.C SHIFT_7.1(QB)
Q7_2: 4R_7_0.3 4R_7_0.6 LED_7_2.C SHIFT_7.2(QC)
Q7_3: 4R_7_0.4 4R_7_0.5 LED_7_3.C SHIFT_7.3(QD)
Q7_4: 4R_7_1.1 4R_7_1.8 LED_7_4.C SHIFT_7.4(QE)
Q7_5: 4R_7_1.2 4R_7_1.7 LED_7_5.C SHIFT_7.5(QF)
Q7_6: 4R_7_1.3 4R_7_1.6 LED_7_6.C SHIFT_7.6(QG)
Q7_7: 4R_7_1.4 4R_7_1.5 LED_7_7.C SHIFT_7.7(QH)
Q8_0: 4R_8_0.1 4R_8_0.8 LED_8_0.C SHIFT_8.15(QA)
Q8_1: 4R_8_0.2 4R_8_0.7 LED_8_1.C SHIFT_8.1(QB)
Q8_2: 4R_8_0.3 4R_8_0.6 LED_8_2.C SHIFT_8.2(QC)
Q8_3: 4R_8_0.4 4R_8_0.5 LED_8_3.C SHIFT_8.3(QD)
Q8_4: 4R_8_1.1 4R_8_1.8 LED_8_4.C SHIFT_8.4(QE)
Q8_5: 4R_8_1.2 4R_8_1.7 LED_8_5.C SHIFT_8.5(QF)
Q8_6: 4R_8_1.3 4R_8_1.6 LED_8_6.C SHIFT_8.6(QG)
Q8_7: 4R_8_1.4 4R_8_1.5 LED_8_7.C SHIFT_8.7(QH)
Q9_0: 4R_9_0.1 4R_9_0.8 LED_9_0.C SHIFT_9.15(QA)
Q9_1: 4R_9_0.2 4R_9_0.7 LED_9_1.C SHIFT_9.1(QB)
Q9_2: 4R_9_0.3 4R_9_0.6 LED_9_2.C SHIFT_9.2(QC)
Q9_3: 4R_9_0.4 4R_9_0.5 LED_9_3.C SHIFT_9.3(QD)
Q9_4: 4R_9_1.1 4R_9_1.8 LED_9_4.C SHIFT_9.4(QE)
Q9_5: 4R_9_1.2 4R_9_1.7 LED_9_5.C SHIFT_9.5(QF)
Q9_6: 4R_9_1.3 4R_9_1.6 LED_9_6.C SHIFT_9.6(QG)
Q9_7: 4R_9_1.4 4R_9_1.5 LED_9_7.C SHIFT_9.7(QH)
Q10_0: 4R_10_0.1 4R_10_0.8 LED_10_0.C SHIFT_10.15(QA)
Q10_1: 4R_10_0.2 4R_10_0.7 LED_10_1.C SHIFT_10.1(QB)
Q10_2: 4R_10_0.3 4R_10_0.6 LED_10_2.C SHIFT_10.2(QC)
Q10_3: 4R_10_0.4 4R_10_0.5 LED_10_3.C SHIFT_10.3(QD)
Q10_4: 4R_10_1.1 4R_10_1.8 LED_10_4.C SHIFT_10.4(QE)
Q10_5: 4R_10_1.2 4R_10_1.7 LED_10_5.C SHIFT_10.5(QF)
Q10_6: 4R_10_1.3 4R_10_1.6 LED_10_6.C SHIFT_10.6(QG)
Q10_7: 4R_10_1.4 4R_10_1.5 LED_10_7.C SHIFT_10.7(QH)
Q11_0: 4R_11_0.1 4R_11_0.8 LED_11_0.C SHIFT_11.15(QA)
Q11_1: 4R_11_0.2 4R_11_0.7 LED_11_1.C SHIFT_11.1(QB)
Q11_2: 4R_11_0.3 4R_11_0.6 LED_11_2.C SHIFT_11.2(QC)
Q11_3: 4R_11_0.4 4R_11_0.5 LED_11_3.C SHIFT_11.3(QD)
Q11_4: 4R_11_1.1 4R_11_1.8 LED_11_4.C SHIFT_11.4(QE)
Q11_5: 4R_11_1.2 4R_11_1.7 LED_11_5.C SHIFT_11.5(QF)
Q11_6: 4R_11_1.3 4R_11_1.6 LED_11_6.C SHIFT_11.6(QG)
Q11_7: 4R_11_1.4 4R_11_1.5 LED_11_7.C SHIFT_11.7(QH)
Q12_0: 4R_12_0.1 4R_12_0.8 LED_12_0.C SHIFT_12.15(QA)
Q12_1: 4R_12_0.2 4R_12_0.7 LED_12_1.C SHIFT_12.1(QB)
Q12_2: 4R_12_0.3 4R_12_0.6 LED_12_2.C SHIFT_12.2(QC)
Q12_3: 4R_12_0.4 4R_12_0.5 LED_12_3.C SHIFT_12.3(QD)
Q12_4: 4R_12_1.1 4R_12_1.8 LED_12_4.C SHIFT_12.4(QE)
Q12_5: 4R_12_1.2 4R_12_1.7 LED_12_5.C SHIFT_12.5(QF)
Q12_6: 4R_12_1.3 4R_12_1.6 LED_12_6.C SHIFT_12.6(QG)
Q12_7: 4R_12_1.4 4R_12_1.5 LED_12_7.C SHIFT_12.7(QH)
Q13_0: 4R_13_0.1 4R_13_0.8 LED_13_0.C SHIFT_13.15(QA)
Q13_1: 4R_13_0.2 4R_13_0.7 LED_13_1.C SHIFT_13.1(QB)
Q13_2: 4R_13_0.3 4R_13_0.6 LED_13_2.C SHIFT_13.2(QC)
Q13_3: 4R_13_0.4 4R_13_0.5 LED_13_3.C SHIFT_13.3(QD)
Q13_4: 4R_13_1.1 4R_13_1.8 LED_13_4.C SHIFT_13.4(QE)
Q13_5: 4R_13_1.2 4R_13_1.7 LED_13_5.C SHIFT_13.5(QF)
Q13_6: 4R_13_1.3 4R_13_1.6 LED_13_6.C SHIFT_13.6(QG)
Q13_7: 4R_13_1.4 4R_13_1.5 LED_13_7.C SHIFT_13.7(QH)
Q14_0: 4R_14_0.1 4R_14_0.8 LED_14_0.C SHIFT_14.15(QA)
Q14_1: 4R_14_0.2 4R_14_0.7 LED_14_1.C SHIFT_14.1(QB)
Q14_2: 4R_14_0.3 4R_14_0.6 LED_14_2.C SHIFT_14.2(QC)
Q14_3: 4R_14_0.4 4R_14_0.5 LED_14_3.C SHIFT_14.3(QD)
Q14_4: 4R_14_1.1 4R_14_1.8 LED_14_4.C SHIFT_14.4(QE)
Q14_5: 4R_14_1.2 4R_14_1.7 LED_14_5.C SHIFT_14.5(QF)
Q14_6: 4R_14_1.3 4R_14_1.6 LED_14_6.C SHIFT_14.6(QG)
Q14_7: 4R_14_1.4 4R_14_1.5 LED_14_7.C SHIFT_14.7(QH)
Q15_0: 4R_15_0.1 4R_15_0.8 LED_15_0.C SHIFT_15.15(QA)
Q15_1: 4R_15_0.2 4R_15_0.7 LED_15_1.C SHIFT_15.1(QB)
Q15_2: 4R_15_0.3 4R_15_0.6 LED_15_2.C SHIFT_15.2(QC)
Q15_3: 4R_15_0.4 4R_15_0.5 LED_15_3.C SHIFT_15.3(QD)
Q15_4: 4R_15_1.1 4R_15_1.8 LED_15_4.C SHIFT_15.4(QE)
Q15_5: 4R_15_1.2 4R_15_1.7 LED_15_5.C SHIFT_15.5(QF)
Q15_6: 4R_15_1.3 4R_15_1.6 LED_15_6.C SHIFT_15.6(QG)
Q15_7: 4R_15_1.4 4R_15_1.5 LED_15_7.C SHIFT_15.7(QH)
Q16_0: 4R_16_0.1 4R_16_0.8 LED_16_0.C SHIFT_16.15(QA)
Q16_1: 4R_16_0.2 4R_16_0.7 LED_16_1.C SHIFT_16.1(QB)
Q16_2: 4R_16_0.3 4R_16_0.6 LED_16_2.C SHIFT_16.2(QC)
Q16_3: 4R_16_0.4 4R_16_0.5 LED_16_3.C SHIFT_16.3(QD)
Q16_4: 4R_16_1.1 4R_16_1.8 LED_16_4.C SHIFT_16.4(QE)
Q16_5: 4R_16_1.2 4R_16_1.7 LED_16_5.C SHIFT_16.5(QF)
Q16_6: 4R_16_1.3 4R_16_1.6 LED_16_6.C SHIFT_16.6(QG)
Q16_7: 4R_16_1.4 4R_16_1.5 LED_16_7.C SHIFT_16.7(QH)
Q17_0: 4R_17_0.1 4R_17_0.8 LED_17_0.C SHIFT_17.15(QA)
Q17_1: 4R_17_0.2 4R_17_0.7 LED_17_1.C SHIFT_17.1(QB)
Q17_2: 4R_17_0.3 4R_17_0.6 LED_17_2.C SHIFT_17.2(QC)
Q17_3: 4R_17_0.4 4R_17_0.5 LED_17_3.C SHIFT_17.3(QD)
Q17_4: 4R_17_1.1 4R_17_1.8 LED_17_4.C SHIFT_17.4(QE)
Q17_5: 4R_17_1.2 4R_17_1.7 LED_17_5.C SHIFT_17.5(QF)
Q17_6: 4R_17_1.3 4R_17_1.6 LED_17_6.C SHIFT_17.6(QG)
Q17_7: 4R_17_1.4 4R_17_1.5 LED_17_7.C SHIFT_17.7(QH)
Q18_0: 4R_18_0.1 4R_18_0.8 LED_18_0.C SHIFT_18.15(QA)
Q18_1: 4R_18_0.2 4R_18_0.7 LED_18_1.C SHIFT_18.1(QB)
Q18_2: 4R_18_0.3 4R_18_0.6 LED_18_2.C SHIFT_18.2(QC)
Q18_3: 4R_18_0.4 4R_18_0.5 LED_18_3.C SHIFT_18.3(QD)
Q18_4: 4R_18_1.1 4R_18_1.8 LED_18_4.C SHIFT_18.4(QE)
Q18_5: 4R_18_1.2 4R_18_1.7 LED_18_5.C SHIFT_18.5(QF)
Q18_6: 4R_18_1.3 4R_18_1.6 LED_18_6.C SHIFT_18.6(QG)
Q18_7: 4R_18_1.4 4R_18_1.5 LED_18_7.C SHIFT_18.7(QH)
Q19_0: 4R_19_0.1 4R_19_0.8 LED_19_0.C SHIFT_19.15(QA)
Q19_1: 4R_19_0.2 4R_19_0.7 LED_19_1.C SHIFT_19.1(QB)
Q19_2: 4R_19_0.3 4R_19_0.6 LED_19_2.C SHIFT_19.2(QC)
Q19_3: 4R_19_0.4 4R_19_0.5 LED_19_3.C SHIFT_19.3(QD)
Q19_4: 4R_19_1.1 4R_19_1.8 LED_19_4.C SHIFT_19.4(QE)
Q19_5: 4R_19_1.2 4R_19_1.7 LED_19_5.C SHIFT_19.5(QF)
Q19_6: 4R_19_1.3 4R_19_1.6 LED_19_6.C SHIFT_19.6(QG)
Q19_7: 4R_19_1.4 4R_19_1.5 LED_19_7.C SHIFT_19.7(QH)
Q20_0: 4R_20_0.1 4R_20_0.8 LED_20_0.C SHIFT_20.15(QA)
Q20_1: 4R_20_0.2 4R_20_0.7 LED_20_1.C SHIFT_20.1(QB)
Q20_2: 4R_20_0.3 4R_20_0.6 LED_20_2.C SHIFT_20.2(QC)
Q20_3: 4R_20_0.4 4R_20_0.5 LED_20_3.C SHIFT_20.3(QD)
Q20_4: 4R_20_1.1 4R_20_1.8 LED_20_4.C SHIFT_20.4(QE)
Q20_5: 4R_20_1.2 4R_20_1.7 LED_20_5.C SHIFT_20.5(QF)
Q20_6: 4R_20_1.3 4R_20_1.6 LED_20_6.C SHIFT_20.6(QG)
Q20_7: 4R_20_1.4 4R_20_1.5 LED_20_7.C SHIFT_20.7(QH)
Q21_0: 4R_21_0.1 4R_21_0.8 LED_21_0.C SHIFT_21.15(QA)
Q21_1: 4R_21_0.2 4R_21_0.7 LED_21_1.C SHIFT_21.1(QB)
Q21_2: 4R_21_0.3 4R_21_0.6 LED_21_2.C SHIFT_21.2(QC)
Q21_3: 4R_21_0.4 4R_21_0.5 LED_21_3.C SHIFT_21.3(QD)
Q21_4: 4R_21_1.1 4R_21_1.8 LED_21_4.C SHIFT_21.4(QE)
Q21_5: 4R_21_1.2 4R_21_1.7 LED_21_5.C SHIFT_21.5(QF)
Q21_6: 4R_21_1.3 4R_21_1.6 LED_21_6.C SHIFT_21.6(QG)
Q21_7: 4R_21_1.4 4R_21_1.5 LED_21_7.C SHIFT_21.7(QH)
Q22_0: 4R_22_0.1 4R_22_0.8 LED_22_0.C SHIFT_22.15(QA)
Q22_1: 4R_22_0.2 4R_22_0.7 LED_22_1.C SHIFT_22.1(QB)
Q22_2: 4R_22_0.3 4R_22_0.6 LED_22_2.C SHIFT_22.2(QC)
Q22_3: 4R_22_0.4 4R_22_0.5 LED_22_3.C SHIFT_22.3(QD)
Q22_4: 4R_22_1.1 4R_22_1.8 LED_22_4.C SHIFT_22.4(QE)
Q22_5: 4R_22_1.2 4R_22_1.7 LED_22_5.C SHIFT_22.5(QF)
Q22_6: 4R_22_1.3 4R_22_1.6 LED_22_6.C SHIFT_22.6(QG)
Q22_7: 4R_22_1.4 4R_22_1.5 LED_22_7.C SHIFT_22.7(QH)
Q23_0: 4R_23_0.1 4R_23_0.8 LED_23_0.C SHIFT_23.15(QA)
Q23_1: 4R_23_0.2 4R_23_0.7 LED_23_1.C SHIFT_23.1(QB)
Q23_2: 4R_23_0.3 4R_23_0.6 LED_23_2.C SHIFT_23.2(QC)
Q23_3: 4R_23_0.4 4R_23_0.5 LED_23_3.C SHIFT_23.3(QD)
Q23_4: 4R_23_1.1 4R_23_1.8 LED_23_4.C SHIFT_23.4(QE)
Q23_5: 4R_23_1.2 4R_23_1.7 LED_23_5.C SHIFT_23.5(QF)
Q23_6: 4R_23_1.3 4R_23_1.6 LED_23_6.C SHIFT_23.6(QG)
Q23_7: 4R_23_1.4 4R_23_1.5 LED_23_7.C SHIFT_23.7(QH)
Q24_0: 4R_24_0.1 4R_24_0.8 LED_24_0.C SHIFT_24.15(QA)
Q24_1: 4R_24_0.2 4R_24_0.7 LED_24_1.C SHIFT_24.1(QB)
Q24_2: 4R_24_0.3 4R_24_0.6 LED_24_2.C SHIFT_24.2(QC)
Q24_3: 4R_24_0.4 4R_24_0.5 LED_24_3.C SHIFT_24.3(QD)
Q24_4: 4R_24_1.1 4R_24_1.8 LED_24_4.C SHIFT_24.4(QE)
Q24_5: 4R_24_1.2 4R_24_1.7 LED_24_5.C SHIFT_24.5(QF)
Q24_6: 4R_24_1.3 4R_24_1.6 LED_24_6.C SHIFT_24.6(QG)
Q24_7: 4R_24_1.4 4R_24_1.5 LED_24_7.C SHIFT_24.7(QH)
Q25_0: 4R_25_0.1 4R_25_0.8 LED_25_0.C SHIFT_25.15(QA)
Q25_1: 4R_25_0.2 4R_25_0.7 LED_25_1.C SHIFT_25.1(QB)
Q25_2: 4R_25_0.3 4R_25_0.6 LED_25_2.C SHIFT_25.2(QC)
Q25_3: 4R_25_0.4 4R_25_0.5 LED_25_3.C SHIFT_25.3(QD)
Q25_4: 4R_25_1.1 4R_25_1.8 LED_25_4.C SHIFT_25.4(QE)
Q25_5: 4R_25_1.2 4R_25_1.7 LED_25_5.C SHIFT_25.5(QF)
Q25_6: 4R_25_1.3 4R_25_1.6 LED_25_6.C SHIFT_25.6(QG)
Q25_7: 4R_25_1.4 4R_25_1.5 LED_25_7.C SHIFT_25.7(QH)
Q26_0: 4R_26_0.1 4R_26_0.8 LED_26_0.C SHIFT_26.15(QA)
Q26_1: 4R_26_0.2 4R_26_0.7 LED_26_1.C SHIFT_26.1(QB)
Q26_2: 4R_26_0.3 4R_26_0.6 LED_26_2.C SHIFT_26.2(QC)
Q26_3: 4R_26_0.4 4R_26_0.5 LED_26_3.C SHIFT_26.3(QD)
Q26_4: 4R_26_1.1 4R_26_1.8 LED_26_4.C SHIFT_26.4(QE)
Q26_5: 4R_26_1.2 4R_26_1.7 LED_26_5.C SHIFT_26.5(QF)
Q26_6: 4R_26_1.3 4R_26_1.6 LED_26_6.C SHIFT_26.6(QG)
Q26_7: 4R_26_1.4 4R_26_1.5 LED_26_7.C SHIFT_26.7(QH)
Q27_0: 4R_27_0.1 4R_27_0.8 LED_27_0.C SHIFT_27.15(QA)
Q27_1: 4R_27_0.2 4R_27_0.7 LED_27_1.C SHIFT_27.1(QB)
Q27_2: 4R_27_0.3 4R_27_0.6 LED_27_2.C SHIFT_27.2(QC)
Q27_3: 4R_27_0.4 4R_27_0.5 LED_27_3.C SHIFT_27.3(QD)
Q27_4: 4R_27_1.1 4R_27_1.8 LED_27_4.C SHIFT_27.4(QE)
Q27_5: 4R_27_1.2 4R_27_1.7 LED_27_5.C SHIFT_27.5(QF)
Q27_6: 4R_27_1.3 4R_27_1.6 LED_27_6.C SHIFT_27.6(QG)
Q27_7: 4R_27_1.4 4R_27_1.5 LED_27_7.C SHIFT_27.7(QH)
Q28_0: 4R_28_0.1 4R_28_0.8 LED_28_0.C SHIFT_28.15(QA)
Q28_1: 4R_28_0.2 4R_28_0.7 LED_28_1.C SHIFT_28.1(QB)
Q28_2: 4R_28_0.3 4R_28_0.6 LED_28_2.C SHIFT_28.2(QC)
Q28_3: 4R_28_0.4 4R_28_0.5 LED_28_3.C SHIFT_28.3(QD)
Q28_4: 4R_28_1.1 4R_28_1.8 LED_28_4.C SHIFT_28.4(QE)
Q28_5: 4R_28_1.2 4R_28_1.7 LED_28_5.C SHIFT_28.5(QF)
Q28_6: 4R_28_1.3 4R_28_1.6 LED_28_6.C SHIFT_28.6(QG)
Q28_7: 4R_28_1.4 4R_28_1.5 LED_28_7.C SHIFT_28.7(QH)
Q29_0: 4R_29_0.1 4R_29_0.8 LED_29_0.C SHIFT_29.15(QA)
Q29_1: 4R_29_0.2 4R_29_0.7 LED_29_1.C SHIFT_29.1(QB)
Q29_2: 4R_29_0.3 4R_29_0.6 LED_29_2.C SHIFT_29.2(QC)
Q29_3: 4R_29_0.4 4R_29_0.5 LED_29_3.C SHIFT_29.3(QD)
Q29_4: 4R_29_1.1 4R_29_1.8 LED_29_4.C SHIFT_29.4(QE)
Q29_5: 4R_29_1.2 4R_29_1.7 LED_29_5.C SHIFT_29.5(QF)
Q29_6: 4R_29_1.3 4R_29_1.6 LED_29_6.C SHIFT_29.6(QG)
Q29_7: 4R_29_1.4 4R_29_1.5 LED_29_7.C SHIFT_29.7(QH)
Q30_0: 4R_30_0.1 4R_30_0.8 LED_30_0.C SHIFT_30.15(QA)
Q30_1: 4R_30_0.2 4R_30_0.7 LED_30_1.C SHIFT_30.1(QB)
Q30_2: 4R_30_0.3 4R_30_0.6 LED_30_2.C SHIFT_30.2(QC)
Q30_3: 4R_30_0.4 4R_30_0.5 LED_30_3.C SHIFT_30.3(QD)
Q30_4: 4R_30_1.1 4R_30_1.8 LED_30_4.C SHIFT_30.4(QE)
Q30_5: 4R_30_1.2 4R_30_1.7 LED_30_5.C SHIFT_30.5(QF)
Q30_6: 4R_30_1.3 4R_30_1.6 LED_30_6.C SHIFT_30.6(QG)
Q30_7: 4R_30_1.4 4R_30_1.5 LED_30_7.C SHIFT_30.7(QH)
Q31_0: 4R_31_0.1 4R_31_0.8 LED_31_0.C SHIFT_31.15(QA)
Q31_1: 4R_31_0.2 4R_31_0.7 LED_31_1.C SHIFT_31.1(QB)
Q31_2: 4R_31_0.3 4R_31_0.6 LED_31_2.C SHIFT_31.2(QC)
Q31_3: 4R_31_0.4 4R_31_0.5 LED_31_3.C SHIFT_31.3(QD)
Q31_4: 4R_31_1.1 4R_31_1.8 LED_31_4.C SHIFT_31.4(QE)
Q31_5: 4R_31_1.2 4R_31_1.7 LED_31_5.C SHIFT_31.5(QF)
Q31_6: 4R_31_1.3 4R_31_1.6 LED_31_6.C SHIFT_31.6(QG)
Q31_7: 4R_31_1.4 4R_31_1.5 LED_31_7.C SHIFT_31.7(QH)
QH_0: SHIFT_0.9(QH*) SHIFT_1.14(SER)
QH_1: SHIFT_1.9(QH*) SHIFT_2.14(SER)
QH_2: SHIFT_2.9(QH*) SHIFT_3.14(SER)
QH_3: SHIFT_3.9(QH*) SHIFT_4.14(SER)
QH_4: SHIFT_4.9(QH*) SHIFT_5.14(SER)
QH_5: SHIFT_5.9(QH*) SHIFT_6.14(SER)
QH_6: SHIFT_6.9(QH*) SHIFT_7.14(SER)
QH_7: SHIFT_7.9(QH*) SHIFT_8.14(SER)
QH_8: SHIFT_8.9(QH*) SHIFT_9.14(SER)
QH_9: SHIFT_9.9(QH*) SHIFT_10.14(SER)
QH_10: SHIFT_10.9(QH*) SHIFT_11.14(SER)
QH_11: SHIFT_11.9(QH*) SHIFT_12.14(SER)
QH_12: SHIFT_12.9(QH*) SHIFT_13.14(SER)
QH_13: SHIFT_13.9(QH*) SHIFT_14.14(SER)
QH_14: SHIFT_14.9(QH*) SHIFT_15.14(SER)
QH_15: SHIFT_15.9(QH*) SHIFT_16.14(SER)
QH_16: SHIFT_16.9(QH*) SHIFT_17.14(SER)
QH_17: SHIFT_17.9(QH*) SHIFT_18.14(SER)
QH_18: SHIFT_18.9(QH*) SHIFT_19.14(SER)
QH_19: SHIFT_19.9(QH*) SHIFT_20.14(SER)
QH_20: SHIFT_20.9(QH*) SHIFT_21.14(SER)
QH_21: SHIFT_21.9(QH*) SHIFT_22.14(SER)
QH_22: SHIFT_22.9(QH*) SHIFT_23.14(SER)
QH_23: SHIFT_23.9(QH*) SHIFT_24.14(SER)
QH_24: SHIFT_24.9(QH*) SHIFT_25.14(SER)
QH_25: SHIFT_25.9(QH*) SHIFT_26.14(SER)
QH_26: SHIFT_26.9(QH*) SHIFT_27.14(SER)
QH_27: SHIFT_27.9(QH*) SHIFT_28.14(SER)
QH_28: SHIFT_28.9(QH*) SHIFT_29.14(SER)
QH_29: SHIFT_29.9(QH*) SHIFT_30.14(SER)
QH_30: J1.1 SHIFT_30.9(QH*) SHIFT_31.14(SER)
STCP: J1.3 SHIFT_0.12(RCK) SHIFT_1.12(RCK) SHIFT_2.12(RCK) SHIFT_3.12(RCK) SHIFT_4.12(RCK) SHIFT_5.12(RCK) SHIFT_6.12(RCK) SHIFT_7.12(RCK) SHIFT_8.12(RCK) SHIFT_9.12(RCK) SHIFT_10.12(RCK) SHIFT_11.12(RCK) SHIFT_12.12(RCK) SHIFT_13.12(RCK) SHIFT_14.12(RCK) SHIFT_15.12(RCK) SHIFT_16.12(RCK) SHIFT_17.12(RCK) SHIFT_18.12(RCK) SHIFT_19.12(RCK) SHIFT_20.12(RCK) SHIFT_21.12(RCK) SHIFT_22.12(RCK) SHIFT_23.12(RCK) SHIFT_24.12(RCK) SHIFT_25.12(RCK) SHIFT_26.12(RCK) SHIFT_27.12(RCK) SHIFT_28.12(RCK) SHIFT_29.12(RCK) SHIFT_30.12(RCK) SHIFT_31.12(RCK)
TRIG: J1.5 J3.3
VCC: C1.+ J2.1 J3.1 SHIFT_0.10(SCL) SHIFT_0.16(VCC) SHIFT_1.10(SCL) SHIFT_1.16(VCC) SHIFT_2.10(SCL) SHIFT_2.16(VCC) SHIFT_3.10(SCL) SHIFT_3.16(VCC) SHIFT_4.10(SCL) SHIFT_4.16(VCC) SHIFT_5.10(SCL) SHIFT_5.16(VCC) SHIFT_6.10(SCL) SHIFT_6.16(VCC) SHIFT_7.10(SCL) SHIFT_7.16(VCC) SHIFT_8.10(SCL) SHIFT_8.16(VCC) SHIFT_9.10(SCL) SHIFT_9.16(VCC) SHIFT_10.10(SCL) SHIFT_10.16(VCC) SHIFT_11.10(SCL) SHIFT_11.16(VCC) SHIFT_12.10(SCL) SHIFT_12.16(VCC) SHIFT_13.10(SCL) SHIFT_13.16(VCC) SHIFT_14.10(SCL) SHIFT_14.16(VCC) SHIFT_15.10(SCL) SHIFT_15.16(VCC) SHIFT_16.10(SCL) SHIFT_16.16(VCC) SHIFT_17.10(SCL) SHIFT_17.16(VCC) SHIFT_18.10(SCL) SHIFT_18.16(VCC) SHIFT_19.10(SCL) SHIFT_19.16(VCC) SHIFT_20.10(SCL) SHIFT_20.16(VCC) SHIFT_21.10(SCL) SHIFT_21.16(VCC) SHIFT_22.10(SCL) SHIFT_22.16(VCC) SHIFT_23.10(SCL) SHIFT_23.16(VCC) SHIFT_24.10(SCL) SHIFT_24.16(VCC) SHIFT_25.10(SCL) SHIFT_25.16(VCC) SHIFT_26.10(SCL) SHIFT_26.16(VCC) SHIFT_27.10(SCL) SHIFT_27.16(VCC) SHIFT_28.10(SCL) SHIFT_28.16(VCC) SHIFT_29.10(SCL) SHIFT_29.16(VCC) SHIFT_30.10(SCL) SHIFT_30.16(VCC) SHIFT_31.10(SCL) SHIFT_31.16(VCC)
Unconnected: H1.B3,2(MOUNT) H2.B3,2(MOUNT) H3.B3,2(MOUNT) H4.B3,2(MOUNT) SHIFT_0.14(SER) SHIFT_31.9(QH*)

## Notes on the sheet
- 11 (SH_CP)
- 13 (OE)
- 12 (ST_CP)
- 14 (DS)
- 5V (MR)

## Library data of the parts
4R_0_0 4R_0_1 4R_1_0 4R_1_1 4R_2_0 4R_2_1 4R_3_0 4R_3_1 4R_4_0 4R_4_1 4R_5_0 4R_5_1 4R_6_0 4R_6_1 4R_7_0 4R_7_1 4R_8_0 4R_8_1 4R_9_0 4R_9_1 4R_10_0 4R_10_1 4R_11_0 4R_11_1 4R_12_0 4R_12_1 4R_13_0 4R_13_1 4R_14_0 4R_14_1 4R_15_0 4R_15_1 4R_16_0 4R_16_1 4R_17_0 4R_17_1 4R_18_0 4R_18_1 4R_19_0 4R_19_1 4R_20_0 4R_20_1 4R_21_0 4R_21_1 4R_22_0 4R_22_1 4R_23_0 4R_23_1 4R_24_0 4R_24_1 4R_25_0 4R_25_1 4R_26_0 4R_26_1 4R_27_0 4R_27_1 4R_28_0 4R_28_1 4R_29_0 4R_29_1 4R_30_0 4R_30_1 4R_31_0 4R_31_1 = resistor-dil:4R-N: Array Chip Resistor Source: RS Component / Phycomp; OC_FARNELL: unknown; OC_NEWARK: unknown
C1 = SparkFun-Capacitors:1000UF: 1,000µF/1mF ceramic capacitors A capacitor is a passive two-terminal electrical component used to store electrical energy temporarily in an electric field. CAP-08070; PROD_ID: CAP-09538; VALUE: 1mF
H1-H4 = holes:MOUNT-PAD-ROUND: MOUNTING PAD, round
J1 = SparkFun-Connectors:CONN_06: Multi connection point. Often used as Generic Header-pin footprint for 0.1 inch spaced/style header connections On any of the 0.1 inch spaced packages, you can populate with these: Break Away Headers - Straight <https://www.sparkfun.com/products/116> (PRT-00116) Break Away Male Headers - Right Angle <https://www.sparkfun.com/products/553> (PRT-00553) Female Headers <https://www.sparkfun.com/products/115> (PRT-00115) Break Away Headers - Machine Pin <https://www.sparkfun.com/products/117> (PRT-00117) Break Away Female Headers - Swiss Machine Pin <https://www.sparkfun.com/products/743> (PRT-00743) Arduino Stackable Header - 6 Pin <https://www.sparkfun.com/products/9280> (PRT-09280) For SCREWTERMINALS and SPRING TERMINALS visit here: Screw Terimnals on SparkFun.com <https://www.sparkfun.com/search/results?term=Screw+Terminals> (5mm/3.5mm/2.54mm spacing) This device is also useful as a general connection point to wire up your design to another part of your project. Our various solder wires solder well into these plated through hole pads. Hook-Up Wire - Assortment (Stranded, 22 AWG) <https://www.sparkfun.com/products/11375> (PRT-11375) Hook-Up Wire - Assortment (Solid Core, 22 AWG) <https://www.sparkfun.com/products/11367> (PRT-11367) View the entire wire category on our website here <https://www.sparkfun.com/categories/141>; PROD_ID: CONN-08437
J2 = SparkFun-Connectors:CONN_02: Multi connection point. Often used as Generic Header-pin footprint for 0.1 inch spaced/style header connections On any of the 0.1 inch spaced packages, you can populate with these: Break Away Headers - Straight <https://www.sparkfun.com/products/116> (PRT-00116) Break Away Male Headers - Right Angle <https://www.sparkfun.com/products/553> (PRT-00553) Female Headers <https://www.sparkfun.com/products/115> (PRT-00115) Break Away Headers - Machine Pin <https://www.sparkfun.com/products/117> (PRT-00117) Break Away Female Headers - Swiss Machine Pin <https://www.sparkfun.com/products/743> (PRT-00743) For SCREWTERMINALS and SPRING TERMINALS visit here: Screw Terimnals on SparkFun.com <https://www.sparkfun.com/search/results?term=Screw+Terminals> (5mm/3.5mm/2.54mm spacing) This device is also useful as a general connection point to wire up your design to another part of your project. Our various solder wires solder well into these plated through hole pads. Hook-Up Wire - Assortment (Stranded, 22 AWG) <https://www.sparkfun.com/products/11375> (PRT-11375) Hook-Up Wire - Assortment (Solid Core, 22 AWG) <https://www.sparkfun.com/products/11367> (PRT-11367) View the entire wire category on our website here <https://www.sparkfun.com/categories/141> Special notes: Molex polarized connector foot print use with: PRT-08233 with associated crimp pins and housings. 2.54_SCREWTERM for use with PRT-10571. 3.5mm Screw Terminal footprints for PRT-08084 5mm Screw Terminal footprints for use with PRT-08432
J3 = SparkFun-Connectors:CONN_04: Multi connection point. Often used as Generic Header-pin footprint for 0.1 inch spaced/style header connections On any of the 0.1 inch spaced packages, you can populate with these: Break Away Headers - Straight <https://www.sparkfun.com/products/116> (PRT-00116) Break Away Male Headers - Right Angle <https://www.sparkfun.com/products/553> (PRT-00553) Female Headers <https://www.sparkfun.com/products/115> (PRT-00115) Break Away Headers - Machine Pin <https://www.sparkfun.com/products/117> (PRT-00117) Break Away Female Headers - Swiss Machine Pin <https://www.sparkfun.com/products/743> (PRT-00743) For SCREWTERMINALS and SPRING TERMINALS visit here: Screw Terimnals on SparkFun.com <https://www.sparkfun.com/search/results?term=Screw+Terminals> (5mm/3.5mm/2.54mm spacing) This device is also useful as a general connection point to wire up your design to another part of your project. Our various solder wires solder well into these plated through hole pads. Hook-Up Wire - Assortment (Stranded, 22 AWG) <https://www.sparkfun.com/products/11375> (PRT-11375) Hook-Up Wire - Assortment (Solid Core, 22 AWG) <https://www.sparkfun.com/products/11367> (PRT-11367) View the entire wire category on our website here <https://www.sparkfun.com/categories/141> Special notes: Molex polarized connector foot print use with SKU : PRT-08231 with associated crimp pins and housings. 1MM SMD Version SKU: PRT-10208; PROD_ID: CONN-09696
LED_0_0 LED_0_1-LED_0_7 LED_1_0 LED_1_1-LED_1_7 LED_2_0 LED_2_1-LED_2_7 LED_3_0 LED_3_1-LED_3_7 LED_4_0 LED_4_1-LED_4_7 LED_5_0 LED_5_1-LED_5_7 LED_6_0 LED_6_1-LED_6_7 LED_7_0 LED_7_1-LED_7_7 LED_8_0 LED_8_1-LED_8_7 LED_9_0 LED_9_1-LED_9_7 LED_10_0 LED_10_1-LED_10_7 LED_11_0 LED_11_1-LED_11_7 LED_12_0 LED_12_1-LED_12_7 LED_13_0 LED_13_1-LED_13_7 LED_14_0 LED_14_1-LED_14_7 LED_15_0 LED_15_1-LED_15_7 LED_16_0 LED_16_1-LED_16_7 LED_17_0 LED_17_1-LED_17_7 LED_18_0 LED_18_1-LED_18_7 LED_19_0 LED_19_1-LED_19_7 LED_20_0 LED_20_1-LED_20_7 LED_21_0 LED_21_1-LED_21_7 LED_22_0 LED_22_1-LED_22_7 LED_23_0 LED_23_1-LED_23_7 LED_24_0 LED_24_1-LED_24_7 LED_25_0 LED_25_1-LED_25_7 LED_26_0 LED_26_1-LED_26_7 LED_27_0 LED_27_1-LED_27_7 LED_28_0 LED_28_1-LED_28_7 LED_29_0 LED_29_1-LED_29_7 LED_30_0 LED_30_1-LED_30_7 LED_31_0 LED_31_1-LED_31_7 = SparkFun-LED:LED-GREEN: Green SMD LED Used in manufacturing of various products at SparkFun Packages: 0603 - SMD 0603 package [Product Link] <http://www.futureelectronics.com/en/technologies/semiconductors/optoelectronics/leds/Pages/9894312-LTST-C190GKT.aspx?CrossPart=HSMG-C190&IM=0> LilyPad 1206 - SMD1206 LilyPad package [Product Link] <http://www.futureelectronics.com/en/Technologies/Product.aspx?ProductID=IN150NGHARVATEKCORPORATION2049943&IM=0> 1206 - SMD1206 package [Product Link] <http://www.futureelectronics.com/en/technologies/semiconductors/optoelectronics/leds/Pages/8315665-LTST-C150KGKT.aspx?IM=0> 1206 Bottom Mount -SMD 1206 Bottom Mount [Product Link] <http://www.digikey.com/product-detail/en/lite-on-inc/LTST-C230KGKT/160-1456-1-ND/386854> SparkFun Products: Pro Mini 328 -5V <https://www.sparkfun.com/products/821> RedBoard <https://www.sparkfun.com/products/12757> MP3 Trigger <https://www.sparkfun.com/products/13720> Makey Makey <https://www.sparkfun.com/products/11076>; PROD_ID: DIO-00821
SHIFT_0 SHIFT_1-SHIFT_31 = SparkFun-IC-Logic:74*595: 8-Bit Shift Register (Serial to Parallel) Datasheet <http://cdn.sparkfun.com/datasheets/BreakoutBoards/MM74HC595.pdf> SparkFun Products SparkFun Shift Register Breakout - 74HC595 <https://www.sparkfun.com/products/10680> (BOB-10680); PROD_ID: IC-07875

## Net classes
0 default: width 0.152 mm, drill 0.152 mm, clearance 0.152 mm